# Altium project AMDC.PrjPCB (part 2 of 4)

## Sheet TranslationDir8Chan.SchDoc: 8-Channel Directional Translation
size Letter; Engineer: Nathan Petersen; DocumentNumber: 15; Revision: v1.2; SheetNumber: 15; SheetTotal: 23
Used 8 times, as channels U_PicoZed/U_DriveInterface/U_InverterTranslation/U_TranslationStsA, U_PicoZed/U_DriveInterface/U_InverterTranslation/U_TranslationStsB, U_PicoZed/U_DriveInterface/U_InverterTranslation/U_TranslationStsC, U_PicoZed/U_DriveInterface/U_InverterTranslation/U_TranslationStsD, U_PicoZed/U_GPIO/U_TranslationGPIO_IN_A, U_PicoZed/U_GPIO/U_TranslationGPIO_OUT_A, U_PicoZed/U_GPIO/U_TranslationGPIO_IN_B, U_PicoZed/U_GPIO/U_TranslationGPIO_OUT_B. Parts and nets are listed once, with the designators drawn on the sheet.
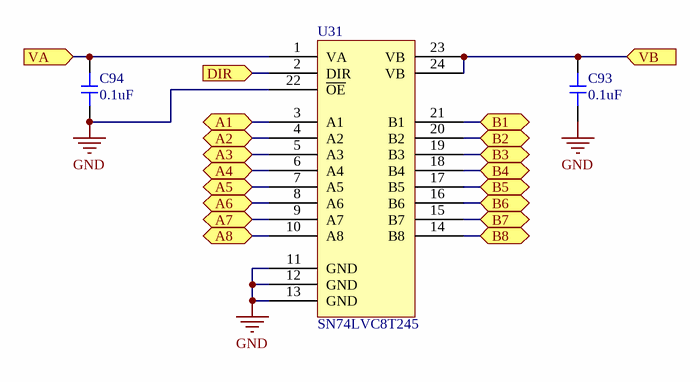
[diagram p7: TranslationDir8Chan.SchDoc]

### Parts
C93  value 0.1uF  [0603-CAP]  (hidden comment: Capacitor)
C94  value 0.1uF  [0603-CAP]  (hidden comment: Capacitor)
U31  SN74LVC8T245  [TSOP65P640X120-24N]

### Ports
A1 (bidir), A2 (bidir), A3 (bidir), A4 (bidir), A5 (bidir), A6 (bidir), A7 (bidir), A8 (bidir), B1 (bidir), B2 (bidir), B3 (bidir), B4 (bidir), B5 (bidir), B6 (bidir), B7 (bidir), B8 (bidir), DIR (in), VA (in), VB (in)

### Nets
GND: C93.2 C94.2 U31.11(GND) U31.12(GND) U31.13(GND) U31.22(~{OE})
A1: U31.3(A1) ; port A1
A2: U31.4(A2) ; port A2
A3: U31.5(A3) ; port A3
A4: U31.6(A4) ; port A4
A5: U31.7(A5) ; port A5
A6: U31.8(A6) ; port A6
A7: U31.9(A7) ; port A7
A8: U31.10(A8) ; port A8
B1: U31.21(B1) ; port B1
B2: U31.20(B2) ; port B2
B3: U31.19(B3) ; port B3
B4: U31.18(B4) ; port B4
B5: U31.17(B5) ; port B5
B6: U31.16(B6) ; port B6
B7: U31.15(B7) ; port B7
B8: U31.14(B8) ; port B8
DIR: U31.2(DIR) ; port DIR
VA: C94.1 U31.1(VA) ; port VA
VB: C93.1 U31.23(VB) U31.24(VB) ; port VB

### Channels
U_PicoZed/U_DriveInterface/U_InverterTranslation/U_TranslationStsA: designators end in A; ports A1=LV_INV_STS_A1 A2=LV_INV_STS_A2 A3=LV_INV_STS_A3 A4=LV_INV_STS_A4 A5=LV_INV_STS_A5 A6=LV_INV_STS_A6 A7=LV_INV_STS_A7 A8=LV_INV_STS_A8 B1=INV_STS_A1 B2=INV_STS_A2 B3=INV_STS_A3 B4=INV_STS_A4 B5=INV_STS_A5 B6=INV_STS_A6 B7=INV_STS_A7 B8=INV_STS_A8 DIR=INV_STS_A_DIR VA=1.8V VB=VDDPS
U_PicoZed/U_DriveInterface/U_InverterTranslation/U_TranslationStsB: designators end in B; ports A1=LV_INV_STS_B1 A2=LV_INV_STS_B2 A3=LV_INV_STS_B3 A4=LV_INV_STS_B4 A5=LV_INV_STS_B5 A6=LV_INV_STS_B6 A7=LV_INV_STS_B7 A8=LV_INV_STS_B8 B1=INV_STS_B1 B2=INV_STS_B2 B3=INV_STS_B3 B4=INV_STS_B4 B5=INV_STS_B5 B6=INV_STS_B6 B7=INV_STS_B7 B8=INV_STS_B8 DIR=INV_STS_B_DIR VA=1.8V VB=VDDPS
U_PicoZed/U_DriveInterface/U_InverterTranslation/U_TranslationStsC: designators end in C; ports A1=LV_INV_STS_C1 A2=LV_INV_STS_C2 A3=LV_INV_STS_C3 A4=LV_INV_STS_C4 A5=LV_INV_STS_C5 A6=LV_INV_STS_C6 A7=LV_INV_STS_C7 A8=LV_INV_STS_C8 B1=INV_STS_C1 B2=INV_STS_C2 B3=INV_STS_C3 B4=INV_STS_C4 B5=INV_STS_C5 B6=INV_STS_C6 B7=INV_STS_C7 B8=INV_STS_C8 DIR=INV_STS_C_DIR VA=1.8V VB=VDDPS
U_PicoZed/U_DriveInterface/U_InverterTranslation/U_TranslationStsD: designators end in D; ports A1=LV_INV_STS_D1 A2=LV_INV_STS_D2 A3=LV_INV_STS_D3 A4=LV_INV_STS_D4 A5=LV_INV_STS_D5 A6=LV_INV_STS_D6 A7=LV_INV_STS_D7 A8=LV_INV_STS_D8 B1=INV_STS_D1 B2=INV_STS_D2 B3=INV_STS_D3 B4=INV_STS_D4 B5=INV_STS_D5 B6=INV_STS_D6 B7=INV_STS_D7 B8=INV_STS_D8 DIR=INV_STS_D_DIR VA=1.8V VB=VDDPS
U_PicoZed/U_GPIO/U_TranslationGPIO_IN_A: designators end in E; ports A1=LV_GPIO1_IN1 A2=LV_GPIO1_IN2 A3=LV_GPIO1_IN3 A4=LV_GPIO2_IN1 A5=LV_GPIO2_IN2 A6=LV_GPIO2_IN3 A7=NetU31E_9 A8=NetU31E_10 B1=GPIO1_IN1 B2=GPIO1_IN2 B3=GPIO1_IN3 B4=GPIO2_IN1 B5=GPIO2_IN2 B6=GPIO2_IN3 B7=GND B8=GND DIR=GND VA=1.8V VB=5V
U_PicoZed/U_GPIO/U_TranslationGPIO_OUT_A: designators end in F; ports A1=LV_GPIO1_OUT1 A2=LV_GPIO1_OUT2 A3=LV_GPIO1_OUT3 A4=LV_GPIO2_OUT1 A5=LV_GPIO2_OUT2 A6=LV_GPIO2_OUT3 A7=GND A8=GND B1=GPIO1_OUT1 B2=GPIO1_OUT2 B3=GPIO1_OUT3 B4=GPIO2_OUT1 B5=GPIO2_OUT2 B6=GPIO2_OUT3 B7=NetU31F_15 B8=NetU31F_14 DIR=1.8V VA=1.8V VB=5V
U_PicoZed/U_GPIO/U_TranslationGPIO_IN_B: designators end in G; ports A1=LV_GPIO3_IN1 A2=LV_GPIO3_IN2 A3=LV_GPIO3_IN3 A4=LV_GPIO4_IN1 A5=LV_GPIO4_IN2 A6=LV_GPIO4_IN3 A7=NetU31G_9 A8=NetU31G_10 B1=GPIO3_IN1 B2=GPIO3_IN2 B3=GPIO3_IN3 B4=GPIO4_IN1 B5=GPIO4_IN2 B6=GPIO4_IN3 B7=GND B8=GND DIR=GND VA=1.8V VB=5V
U_PicoZed/U_GPIO/U_TranslationGPIO_OUT_B: designators end in H; ports A1=LV_GPIO3_OUT1 A2=LV_GPIO3_OUT2 A3=LV_GPIO3_OUT3 A4=LV_GPIO4_OUT1 A5=LV_GPIO4_OUT2 A6=LV_GPIO4_OUT3 A7=GND A8=GND B1=GPIO3_OUT1 B2=GPIO3_OUT2 B3=GPIO3_OUT3 B4=GPIO4_OUT1 B5=GPIO4_OUT2 B6=GPIO4_OUT3 B7=NetU31H_15 B8=NetU31H_14 DIR=1.8V VA=1.8V VB=5V

### Notes on the sheet
- Title:
- File:
- Sheet:
- of
- Revision:
- Time:
- Date:
- Engineer:

### Library data of the parts
U31 = SN74LVC8T245PWR: IC BUS TRANSCVR 8BIT 24TSSOP; Supplier 1: Digi-Key; Supplier Part Number 1: 296-18593-1-ND
C93 C94 = Capacitor: Supplier 1: Digi-Key; Supplier Part Number 1: 1276-1012-6-ND

## Sheet AnalogInterface.SchDoc: Analog Interface
size Letter; Engineer: Nathan Petersen; DocumentNumber: 6; Revision: v1.2; SheetNumber: 6; SheetTotal: 23
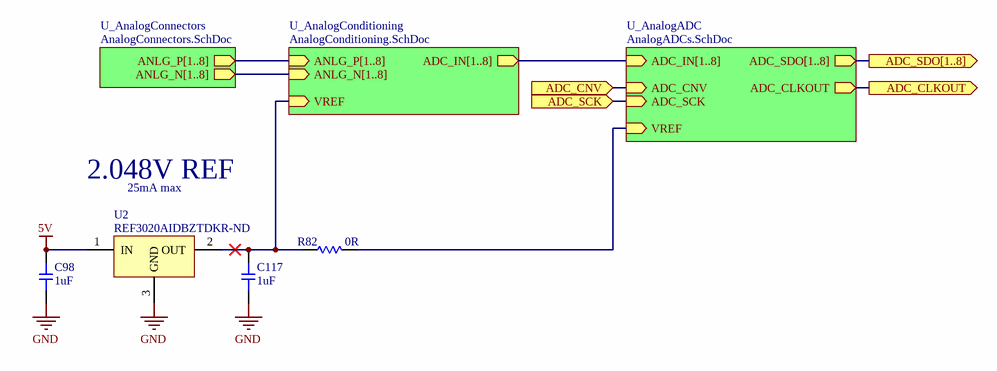
[diagram p8: AnalogInterface.SchDoc]

### Parts
C98  value 1uF  [0603-CAP]  (hidden comment: Capacitor)
C117  value 1uF  [0603-CAP]  (hidden comment: Capacitor)
R82  value 0R  [1206-RES]  (hidden comment: Resistor)
U2  Supplier Part Number 1: REF3020AIDBZTDKR-ND  [SOT23-3]  (hidden comment: REF3020AIDBZT)

### Sub-sheets
U_AnalogADC = AnalogADCs.SchDoc: ADC_IN[1..8] (in), ADC_SDO[1..8] (out), ADC_CNV (in), ADC_SCK (in), ADC_CLKOUT (out), VREF (in)
U_AnalogConditioning = AnalogConditioning.SchDoc: ADC_IN[1..8] (out), ANLG_N[1..8] (in), ANLG_P[1..8] (in), VREF (in)
U_AnalogConnectors = AnalogConnectors.SchDoc: ANLG_P[1..8] (out), ANLG_N[1..8] (out)

### Ports
ADC_CLKOUT (out), ADC_CNV (in), ADC_SCK (in), ADC_SDO[1..8] (out)

### Nets
5V: C98.2 U2.1(IN)
GND: C98.1 C117.1 U2.3(GND)
ADC_CLKOUT: port ADC_CLKOUT, sheet U_AnalogADC/ADC_CLKOUT
ADC_CNV: port ADC_CNV, sheet U_AnalogADC/ADC_CNV
ADC_SCK: port ADC_SCK, sheet U_AnalogADC/ADC_SCK
VREF: R82.2 ; sheet U_AnalogADC/VREF
NetC117_2: C117.2 R82.1 U2.2(OUT) ; sheet U_AnalogConditioning/VREF

### Buses and harness runs
bus port ADC_SDO[1..8] = sheet U_AnalogADC/ADC_SDO[1..8]
bus sheet U_AnalogADC/ADC_IN[1..8] = sheet U_AnalogConditioning/ADC_IN[1..8]
bus sheet U_AnalogConditioning/ANLG_N[1..8] = sheet U_AnalogConnectors/ANLG_N[1..8]
bus sheet U_AnalogConditioning/ANLG_P[1..8] = sheet U_AnalogConnectors/ANLG_P[1..8]

### Notes on the sheet
- 2.048V REF
- 25mA max
- Title:
- File:
- Sheet:
- of
- Revision:
- Time:
- Date:
- Engineer:

### Library data of the parts
U2 = REF3020AIDBZT: Series Voltage Reference IC ±0.2% 25mA SOT-23-3; Supplier 1: Digi-Key
C98 C117 = Capacitor: Supplier 1: Digi-Key; Supplier Part Number 1: 1276-6524-6-ND
R82 = Resistor: Supplier 1: Digi-Key; Supplier Part Number 1: 311-0.0ERCT-ND

## Sheet AnalogADCs.SchDoc: ADC
size Letter; Engineer: Nathan Petersen; DocumentNumber: 10; Revision: v1.2; SheetNumber: 10; SheetTotal: 23
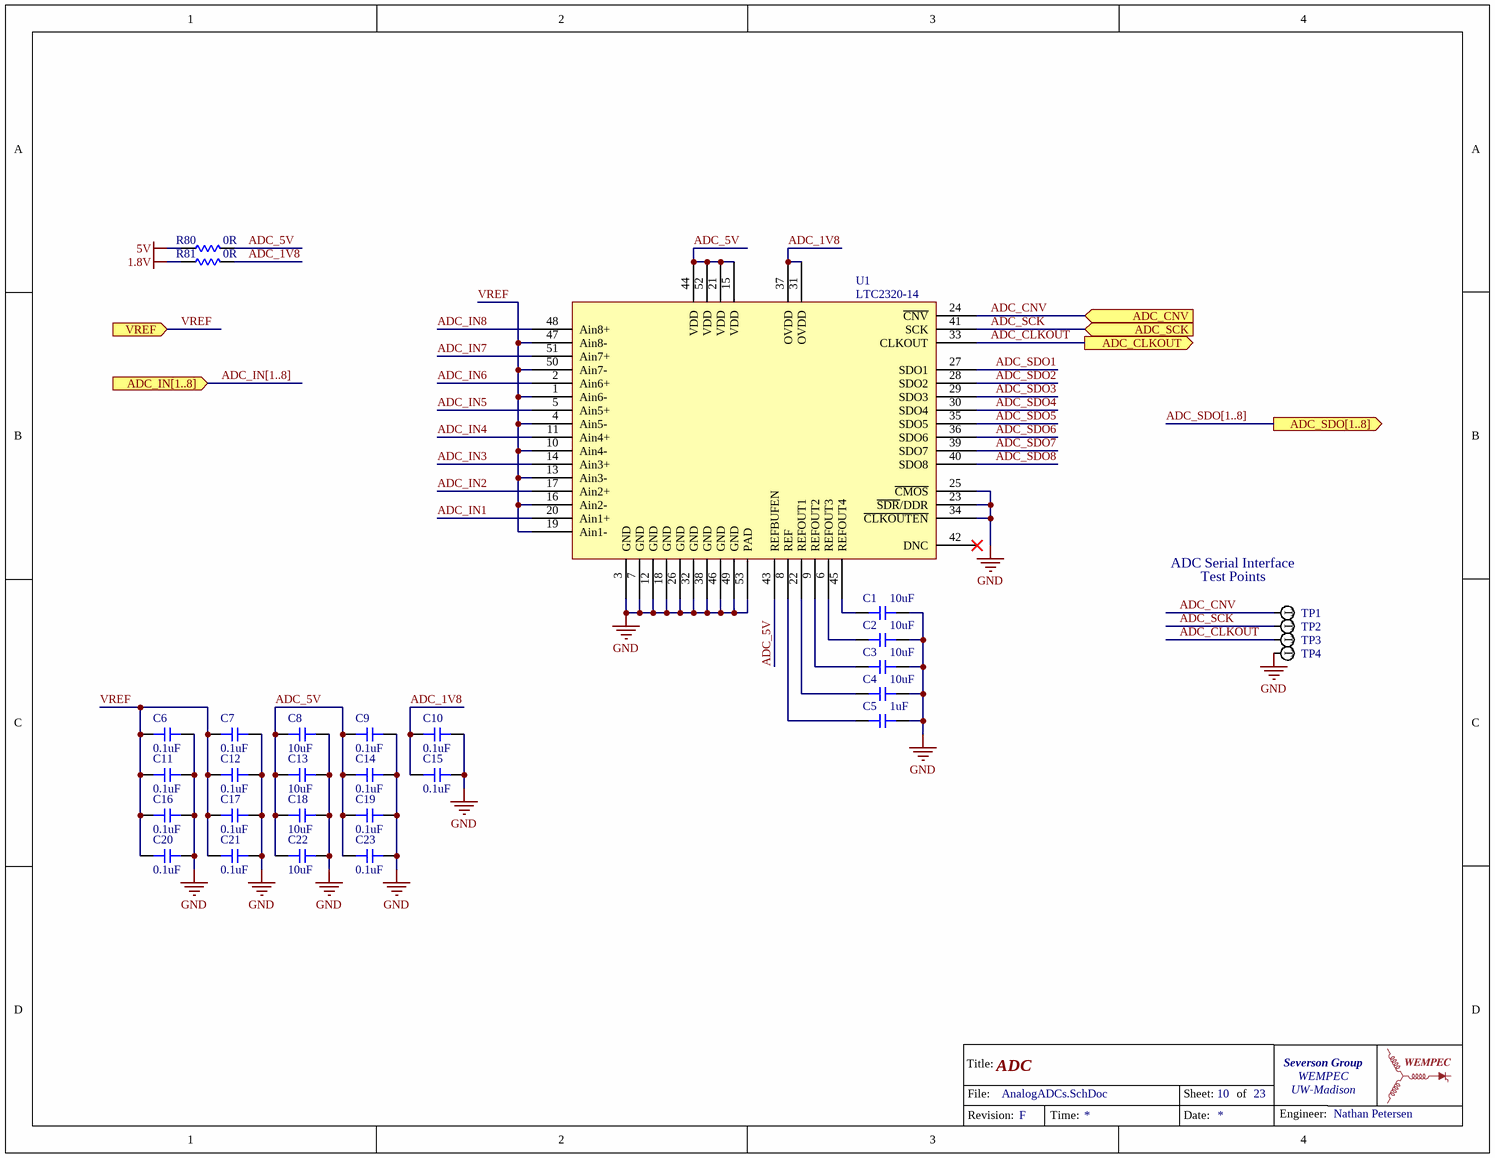
[diagram p9: AnalogADCs.SchDoc]

### Parts
C1  value 10uF  [0603-CAP]  (hidden comment: Capacitor)
C2  value 10uF  [0603-CAP]  (hidden comment: Capacitor)
C3  value 10uF  [0603-CAP]  (hidden comment: Capacitor)
C4  value 10uF  [0603-CAP]  (hidden comment: Capacitor)
C5  value 1uF  [0603-CAP]  (hidden comment: Capacitor)
C6  value 0.1uF  [0603-CAP]  (hidden comment: Capacitor)
C7  value 0.1uF  [0603-CAP]  (hidden comment: Capacitor)
C8  value 10uF  [0603-CAP]  (hidden comment: Capacitor)
C9  value 0.1uF  [0603-CAP]  (hidden comment: Capacitor)
C10  value 0.1uF  [0603-CAP]  (hidden comment: Capacitor)
C11  value 0.1uF  [0603-CAP]  (hidden comment: Capacitor)
C12  value 0.1uF  [0603-CAP]  (hidden comment: Capacitor)
C13  value 10uF  [0603-CAP]  (hidden comment: Capacitor)
C14  value 0.1uF  [0603-CAP]  (hidden comment: Capacitor)
C15  value 0.1uF  [0603-CAP]  (hidden comment: Capacitor)
C16  value 0.1uF  [0603-CAP]  (hidden comment: Capacitor)
C17  value 0.1uF  [0603-CAP]  (hidden comment: Capacitor)
C18  value 10uF  [0603-CAP]  (hidden comment: Capacitor)
C19  value 0.1uF  [0603-CAP]  (hidden comment: Capacitor)
C20  value 0.1uF  [0603-CAP]  (hidden comment: Capacitor)
C21  value 0.1uF  [0603-CAP]  (hidden comment: Capacitor)
C22  value 10uF  [0603-CAP]  (hidden comment: Capacitor)
C23  value 0.1uF  [0603-CAP]  (hidden comment: Capacitor)
R80  value 0R  [1206-RES]  (hidden comment: Resistor)
R81  value 0R  [1206-RES]  (hidden comment: Resistor)
TP1  Test Point  [RCU-0C]  (value not drawn)
TP2  Test Point  [RCU-0C]  (value not drawn)
TP3  Test Point  [RCU-0C]  (value not drawn)
TP4  Test Point  [RCU-0C]  (value not drawn)
U1  LTC2320-14  [QFN50P700X800X80_HS-53N]

### Ports
ADC_CLKOUT (out), ADC_CNV (in), ADC_IN[1..8] (in), ADC_SCK (in), ADC_SDO[1..8] (out), VREF (in)

### Nets
1.8V: R81.1
5V: R80.1
GND: C1.2 C2.2 C3.2 C4.2 C5.2 C6.2 C7.2 C8.2 C9.2 C10.2 C11.2 C12.2 C13.2 C14.2 C15.2 C16.2 C17.2 C18.2 C19.2 C20.2 C21.2 C22.2 C23.2 TP4.1 U1.3(GND) U1.7(GND) U1.12(GND) U1.18(GND) U1.23(~{SDR}/DDR) U1.25(~{CMOS}) U1.26(GND) U1.32(GND) U1.34(~{CLKOUTEN}) U1.38(GND) U1.46(GND) U1.49(GND) U1.53(PAD)
ADC_1V8: C10.1 C15.1 R81.2 U1.31(OVDD) U1.37(OVDD)
ADC_5V: C8.1 C9.1 C13.1 C14.1 C18.1 C19.1 C22.1 C23.1 R80.2 U1.15(VDD) U1.21(VDD) U1.43(REFBUFEN) U1.44(VDD) U1.52(VDD)
ADC_CLKOUT: TP3.1 U1.33(CLKOUT) ; port ADC_CLKOUT
ADC_CNV: TP1.1 U1.24(~{CNV}) ; port ADC_CNV
ADC_IN1: U1.20(Ain1+)
ADC_IN2: U1.17(Ain2+)
ADC_IN3: U1.14(Ain3+)
ADC_IN4: U1.11(Ain4+)
ADC_IN5: U1.5(Ain5+)
ADC_IN6: U1.2(Ain6+)
ADC_IN7: U1.51(Ain7+)
ADC_IN8: U1.48(Ain8+)
ADC_SCK: TP2.1 U1.41(SCK) ; port ADC_SCK
ADC_SDO1: U1.27(SDO1)
ADC_SDO2: U1.28(SDO2)
ADC_SDO3: U1.29(SDO3)
ADC_SDO4: U1.30(SDO4)
ADC_SDO5: U1.35(SDO5)
ADC_SDO6: U1.36(SDO6)
ADC_SDO7: U1.39(SDO7)
ADC_SDO8: U1.40(SDO8)
VREF: C6.1 C7.1 C11.1 C12.1 C16.1 C17.1 C20.1 C21.1 U1.1(Ain6-) U1.4(Ain5-) U1.10(Ain4-) U1.13(Ain3-) U1.16(Ain2-) U1.19(Ain1-) U1.47(Ain8-) U1.50(Ain7-) ; port VREF
NetC1_1: C1.1 U1.45(REFOUT4)
NetC2_1: C2.1 U1.6(REFOUT3)
NetC3_1: C3.1 U1.9(REFOUT2)
NetC4_1: C4.1 U1.22(REFOUT1)
NetC5_1: C5.1 U1.8(REF)

Not connected (* = marked no-connect by the designer): U1 42(DNC)*

### Buses and harness runs
bus ADC_IN[1..8] = port ADC_IN[1..8]
bus ADC_SDO[1..8] = port ADC_SDO[1..8]

### Notes on the sheet
- ADC Serial Interface
- Test Points
- Title:
- File:
- Sheet:
- of
- Revision:
- Time:
- Date:
- Engineer:
- (in symbol Test Point) T

### Library data of the parts
U1 = LTC2320-14: IC ADC 14BIT 1.5MSPS SAR 52QFN - 14 Bit Analog to Digital Converter 8 Input 4 SAR 52-QFN (7x8); Supplier 1: Digi-Key; Supplier Part Number 1: LTC2320CUKG-14#PBF-ND
C1-C23 = Capacitor: Supplier 1: Digi-Key
  C1: Supplier Part Number 1: 1276-1192-6-ND
  C2-C4 C8 C13 C18 C22: Supplier Part Number 1: 1276-1119-6-ND
  C5: Supplier Part Number 1: 1276-6524-6-ND
  C6 C7 C9-C12 C14-C17 C19-C21 C23: Supplier Part Number 1: 1276-1012-6-ND
R80 R81 = Resistor: Supplier 1: Digi-Key; Supplier Part Number 1: 311-0.0ERCT-ND
TP1-TP4 = Test Point: Footprint: *; Supplier 1: Digi-Key; Supplier Part Number 1: A106145CT-ND

## Sheet AnalogConnectors.SchDoc: Analog RJ45 Connectors
size Letter; Engineer: Nathan Petersen; DocumentNumber: 7; Revision: v1.2; SheetNumber: 7; SheetTotal: 23
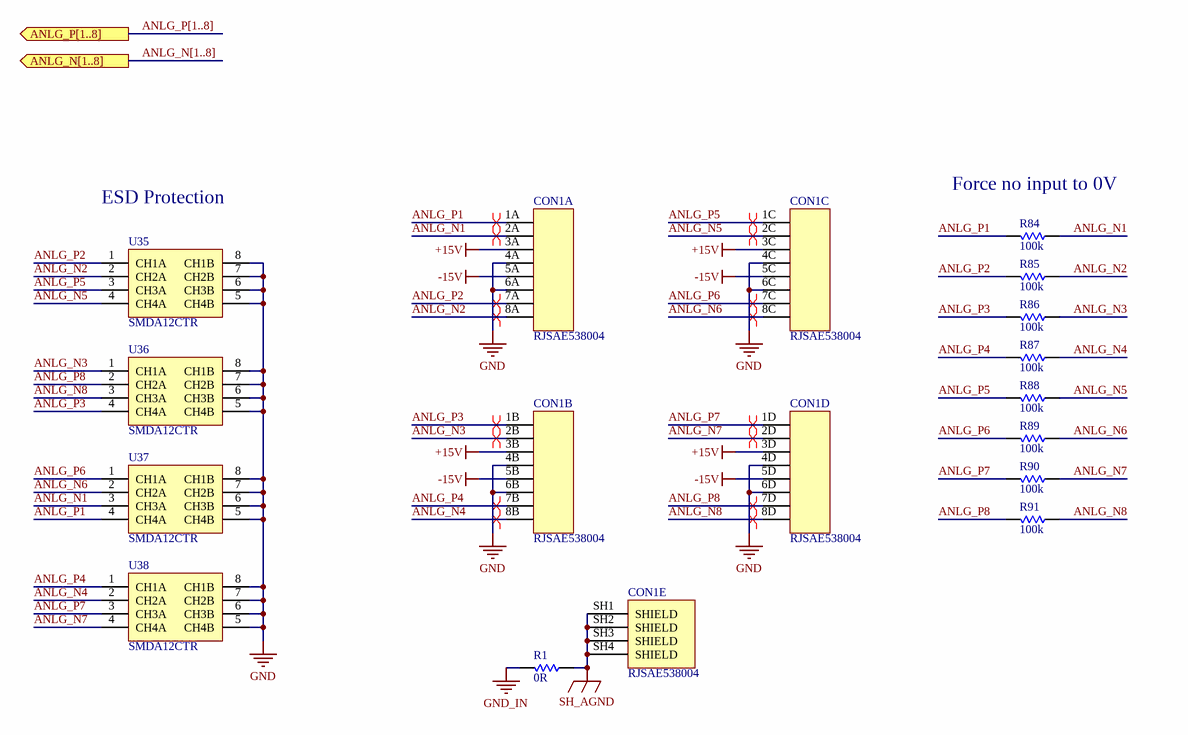
[diagram p10: AnalogConnectors.SchDoc]

### Parts
CON1  RJSAE538004  [RJSAE538004]  (parts A,B,C,D,E of 5)
R1  value 0R  [1206-RES]  (hidden comment: Resistor)
R84  value 100k  [0603-RES]  (hidden comment: Resistor)
R85  value 100k  [0603-RES]  (hidden comment: Resistor)
R86  value 100k  [0603-RES]  (hidden comment: Resistor)
R87  value 100k  [0603-RES]  (hidden comment: Resistor)
R88  value 100k  [0603-RES]  (hidden comment: Resistor)
R89  value 100k  [0603-RES]  (hidden comment: Resistor)
R90  value 100k  [0603-RES]  (hidden comment: Resistor)
R91  value 100k  [0603-RES]  (hidden comment: Resistor)
U35  SMDA12CTR  [SOIC127P600X175-8N]
U36  SMDA12CTR  [SOIC127P600X175-8N]
U37  SMDA12CTR  [SOIC127P600X175-8N]
U38  SMDA12CTR  [SOIC127P600X175-8N]

### Ports
ANLG_N[1..8] (out), ANLG_P[1..8] (out)

### Nets
+15V: CON1.3A CON1.3B CON1.3C CON1.3D
-15V: CON1.5A CON1.5B CON1.5C CON1.5D
GND: CON1.4A CON1.4B CON1.4C CON1.4D CON1.6A CON1.6B CON1.6C CON1.6D U35.5(CH4B) U35.6(CH3B) U35.7(CH2B) U35.8(CH1B) U36.5(CH4B) U36.6(CH3B) U36.7(CH2B) U36.8(CH1B) U37.5(CH4B) U37.6(CH3B) U37.7(CH2B) U37.8(CH1B) U38.5(CH4B) U38.6(CH3B) U38.7(CH2B) U38.8(CH1B)
GND_IN: R1.2
SH_AGND: CON1.SH1(SHIELD) CON1.SH2(SHIELD) CON1.SH3(SHIELD) CON1.SH4(SHIELD) R1.1
ANLG_N1: CON1.2A R84.1 U37.3(CH3A)
ANLG_N2: CON1.8A R85.1 U35.2(CH2A)
ANLG_N3: CON1.2B R86.1 U36.1(CH1A)
ANLG_N4: CON1.8B R87.1 U38.2(CH2A)
ANLG_N5: CON1.2C R88.1 U35.4(CH4A)
ANLG_N6: CON1.8C R89.1 U37.2(CH2A)
ANLG_N7: CON1.2D R90.1 U38.4(CH4A)
ANLG_N8: CON1.8D R91.1 U36.3(CH3A)
ANLG_P1: CON1.1A R84.2 U37.4(CH4A)
ANLG_P2: CON1.7A R85.2 U35.1(CH1A)
ANLG_P3: CON1.1B R86.2 U36.4(CH4A)
ANLG_P4: CON1.7B R87.2 U38.1(CH1A)
ANLG_P5: CON1.1C R88.2 U35.3(CH3A)
ANLG_P6: CON1.7C R89.2 U37.1(CH1A)
ANLG_P7: CON1.1D R90.2 U38.3(CH3A)
ANLG_P8: CON1.7D R91.2 U36.2(CH2A)

### Buses and harness runs
bus ANLG_N[1..8] = port ANLG_N[1..8]
bus ANLG_P[1..8] = port ANLG_P[1..8]

### Layout directives
differential pair: ANLG_N1, ANLG_N2, ANLG_N3, ANLG_N4, ANLG_N5, ANLG_N6, ANLG_N7, ANLG_N8, ANLG_P1, ANLG_P2, ANLG_P3, ANLG_P4, ANLG_P5, ANLG_P6, ANLG_P7, ANLG_P8

### Notes on the sheet
- ESD Protection
- (near R84) Force no input to 0V
- Title:
- File:
- Sheet:
- of
- Revision:
- Time:
- Date:
- Engineer:

### Library data of the parts
CON1 = RJSAE538004: CONN MOD JACK 8P8C R/A SHIELDED; Supplier 1: Digi-Key; Supplier Part Number 1: RJSAE538004-ND
U35-U38 = SMDA12CTR: TVS DIODE 12V 19V 8SO; Supplier 1: Digi-Key; Supplier Part Number 1: 1655-1701-1-ND
R1 R84-R91 = Resistor: Supplier 1: Digi-Key
  R1: Supplier Part Number 1: 311-0.0ERCT-ND
  R84-R91: Supplier Part Number 1: 311-100KLDCT-ND

## Sheet AnalogConditioning.SchDoc: Analog Signal Conditioning
size Letter; Engineer: Nathan Petersen; DocumentNumber: 8; Revision: v1.2; SheetNumber: 8; SheetTotal: 23
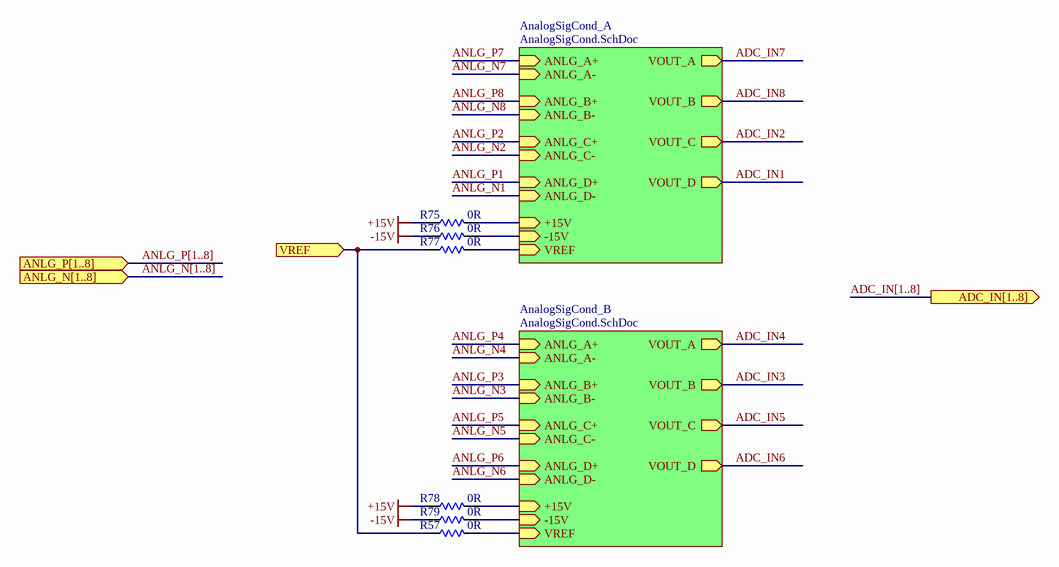
[diagram p11: AnalogConditioning.SchDoc]

### Parts
R57  value 0R  [1206-RES]  (hidden comment: Resistor)
R75  value 0R  [1206-RES]  (hidden comment: Resistor)
R76  value 0R  [1206-RES]  (hidden comment: Resistor)
R77  value 0R  [1206-RES]  (hidden comment: Resistor)
R78  value 0R  [1206-RES]  (hidden comment: Resistor)
R79  value 0R  [1206-RES]  (hidden comment: Resistor)

### Sub-sheets
AnalogSigCond_A = AnalogSigCond.SchDoc: +15V (in), -15V (in), VREF (in), ANLG_A+ (in), ANLG_A- (in), ANLG_B+ (in), ANLG_B- (in), ANLG_C+ (in), ANLG_C- (in), ANLG_D+ (in), ANLG_D- (in), VOUT_A (out), VOUT_B (out), VOUT_C (out), VOUT_D (out)
AnalogSigCond_B = AnalogSigCond.SchDoc: +15V (in), -15V (in), VREF (in), ANLG_A+ (in), ANLG_A- (in), ANLG_B+ (in), ANLG_B- (in), ANLG_C+ (in), ANLG_C- (in), ANLG_D+ (in), ANLG_D- (in), VOUT_A (out), VOUT_B (out), VOUT_C (out), VOUT_D (out)

### Ports
ADC_IN[1..8] (out), ANLG_N[1..8] (in), ANLG_P[1..8] (in), VREF (in)

### Nets
+15V: R75.1 R78.1
-15V: R76.1 R79.1
+15V: R75.2 ; sheet AnalogSigCond_A/+15V  [a separate net that carries the same name]
+15V: R78.2 ; sheet AnalogSigCond_B/+15V  [a separate net that carries the same name]
-15V: R76.2 ; sheet AnalogSigCond_A/-15V  [a separate net that carries the same name]
-15V: R79.2 ; sheet AnalogSigCond_B/-15V  [a separate net that carries the same name]
VREF: R77.2 ; sheet AnalogSigCond_A/VREF
VREF: R57.2 ; sheet AnalogSigCond_B/VREF  [a separate net that carries the same name]
NetC117_2: R57.1 R77.1 ; port VREF

### Buses and harness runs
bus ADC_IN[1..8] = port ADC_IN[1..8]
bus ANLG_N[1..8] = port ANLG_N[1..8]
bus ANLG_P[1..8] = port ANLG_P[1..8]

### Notes on the sheet
- Title:
- File:
- Sheet:
- of
- Revision:
- Time:
- Date:
- Engineer:

### Library data of the parts
R57 R75-R79 = Resistor: Supplier 1: Digi-Key; Supplier Part Number 1: 311-0.0ERCT-ND

## Sheet AnalogSigCond.SchDoc: Analog Signal Front-End
size Letter; Engineer: Nathan Petersen; DocumentNumber: 9; Revision: v1.2; SheetNumber: 9; SheetTotal: 23
Used 2 times, as channels U_PicoZed/U_AnalogInterface/U_AnalogConditioning/AnalogSigCond_A, U_PicoZed/U_AnalogInterface/U_AnalogConditioning/AnalogSigCond_B. Parts and nets are listed once, with the designators drawn on the sheet.
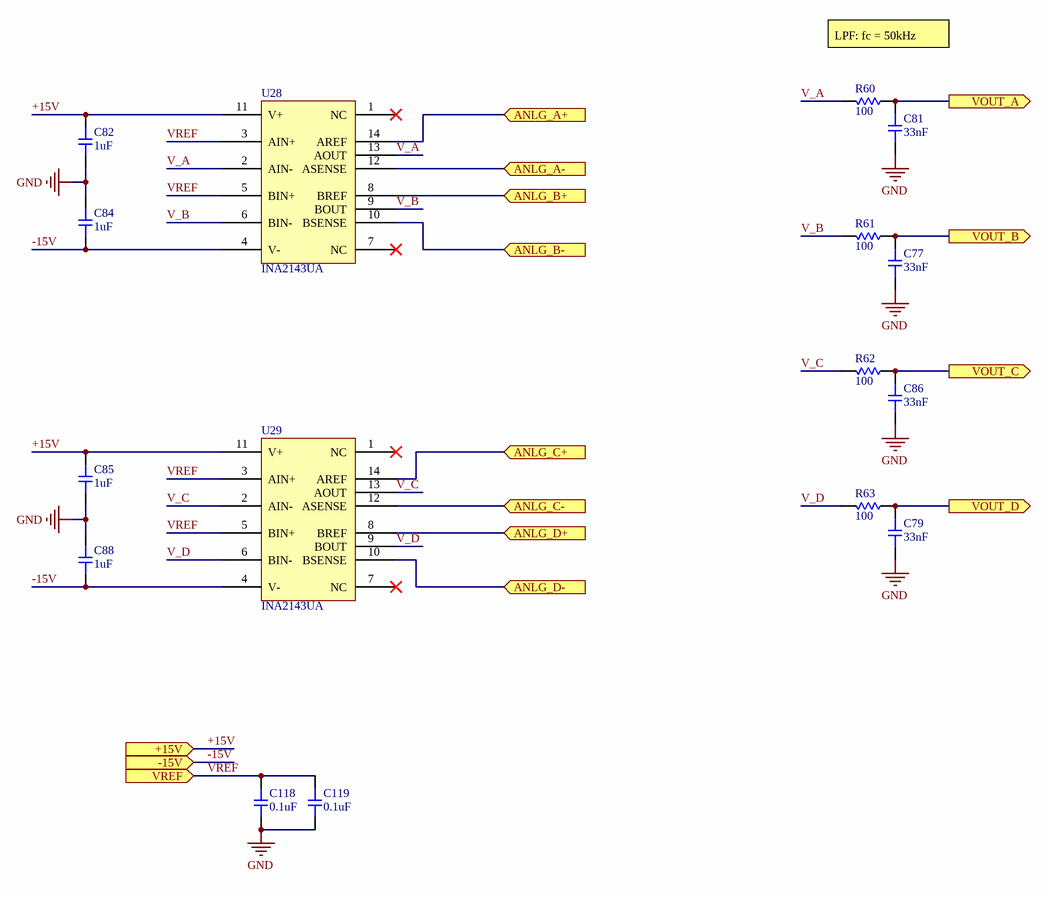
[diagram p12: AnalogSigCond.SchDoc]

### Parts
C77  value 33nF  [0603-CAP]  (hidden comment: Capacitor)
C79  value 33nF  [0603-CAP]  (hidden comment: Capacitor)
C81  value 33nF  [0603-CAP]  (hidden comment: Capacitor)
C82  value 1uF  [0603-CAP]  (hidden comment: Capacitor)
C84  value 1uF  [0603-CAP]  (hidden comment: Capacitor)
C85  value 1uF  [0603-CAP]  (hidden comment: Capacitor)
C86  value 33nF  [0603-CAP]  (hidden comment: Capacitor)
C88  value 1uF  [0603-CAP]  (hidden comment: Capacitor)
C118  value 0.1uF  [0603-CAP]  (hidden comment: Capacitor)
C119  value 0.1uF  [0603-CAP]  (hidden comment: Capacitor)
R60  value 100  [0603-RES]  (hidden comment: Resistor)
R61  value 100  [0603-RES]  (hidden comment: Resistor)
R62  value 100  [0603-RES]  (hidden comment: Resistor)
R63  value 100  [0603-RES]  (hidden comment: Resistor)
U28  INA2143UA  [SOIC127P600X175-14N]
U29  INA2143UA  [SOIC127P600X175-14N]

### Ports
+15V (in), -15V (in), ANLG_A+ (in), ANLG_A- (in), ANLG_B+ (in), ANLG_B- (in), ANLG_C+ (in), ANLG_C- (in), ANLG_D+ (in), ANLG_D- (in), VOUT_A (out), VOUT_B (out), VOUT_C (out), VOUT_D (out), VREF (in)

### Nets
GND: C77.2 C79.2 C81.2 C82.1 C84.2 C85.1 C86.2 C88.2 C118.2 C119.2
+15V: C82.2 C85.2 U28.11(V+) U29.11(V+) ; port +15V
-15V: C84.1 C88.1 U28.4(V-) U29.4(V-) ; port -15V
ANLG_A+: U28.14(AREF) ; port ANLG_A+
ANLG_A-: U28.12(ASENSE) ; port ANLG_A-
ANLG_B+: U28.8(BREF) ; port ANLG_B+
ANLG_B-: U28.10(BSENSE) ; port ANLG_B-
ANLG_C+: U29.14(AREF) ; port ANLG_C+
ANLG_C-: U29.12(ASENSE) ; port ANLG_C-
ANLG_D+: U29.8(BREF) ; port ANLG_D+
ANLG_D-: U29.10(BSENSE) ; port ANLG_D-
V_A: R60.2 U28.2(AIN-) U28.13(AOUT)
V_B: R61.2 U28.6(BIN-) U28.9(BOUT)
V_C: R62.2 U29.2(AIN-) U29.13(AOUT)
V_D: R63.2 U29.6(BIN-) U29.9(BOUT)
VOUT_A: C81.1 R60.1 ; port VOUT_A
VOUT_B: C77.1 R61.1 ; port VOUT_B
VOUT_C: C86.1 R62.1 ; port VOUT_C
VOUT_D: C79.1 R63.1 ; port VOUT_D
VREF: C118.1 C119.1 U28.3(AIN+) U28.5(BIN+) U29.3(AIN+) U29.5(BIN+) ; port VREF

Not connected (* = marked no-connect by the designer): U28 1(NC)* 7(NC)*; U29 1(NC)* 7(NC)*

### Channels
U_PicoZed/U_AnalogInterface/U_AnalogConditioning/AnalogSigCond_A: designators end in A; ports +15V=+15V -15V=-15V ANLG_A+=ANLG_P7 ANLG_A-=ANLG_N7 ANLG_B+=ANLG_P8 ANLG_B-=ANLG_N8 ANLG_C+=ANLG_P2 ANLG_C-=ANLG_N2 ANLG_D+=ANLG_P1 ANLG_D-=ANLG_N1 VOUT_A=ADC_IN7 VOUT_B=ADC_IN8 VOUT_C=ADC_IN2 VOUT_D=ADC_IN1 VREF=VREF
U_PicoZed/U_AnalogInterface/U_AnalogConditioning/AnalogSigCond_B: designators end in B; ports +15V=+15V -15V=-15V ANLG_A+=ANLG_P4 ANLG_A-=ANLG_N4 ANLG_B+=ANLG_P3 ANLG_B-=ANLG_N3 ANLG_C+=ANLG_P5 ANLG_C-=ANLG_N5 ANLG_D+=ANLG_P6 ANLG_D-=ANLG_N6 VOUT_A=ADC_IN4 VOUT_B=ADC_IN3 VOUT_C=ADC_IN5 VOUT_D=ADC_IN6 VREF=VREF

### Notes on the sheet
- LPF: fc = 50kHz
- Title:
- File:
- Sheet:
- of
- Revision:
- Time:
- Date:
- Engineer:

### Library data of the parts
U28 U29 = INA2143UA: IC OPAMP DIFF 150KHZ 14SOIC; Supplier 1: Digi-Key; Supplier Part Number 1: INA2143UA-ND
C77 C79 C81 C82 C84-C86 C88 C118 C119 = Capacitor: Supplier 1: Digi-Key
  C77 C79 C81 C86: Supplier Part Number 1: 1276-2041-1-ND
  C82 C84 C85 C88: Supplier Part Number 1: 1276-6524-6-ND
  C118 C119: Supplier Part Number 1: 1276-1012-6-ND
R60-R63 = Resistor: Supplier 1: Digi-Key; Supplier Part Number 1: YAG3561DKR-ND

## Sheet GbEthernet.SchDoc: SoM Gb Ethernet
size Letter; Engineer: Nathan Petersen; DocumentNumber: 20; Revision: v1.2; SheetNumber: 20; SheetTotal: 23
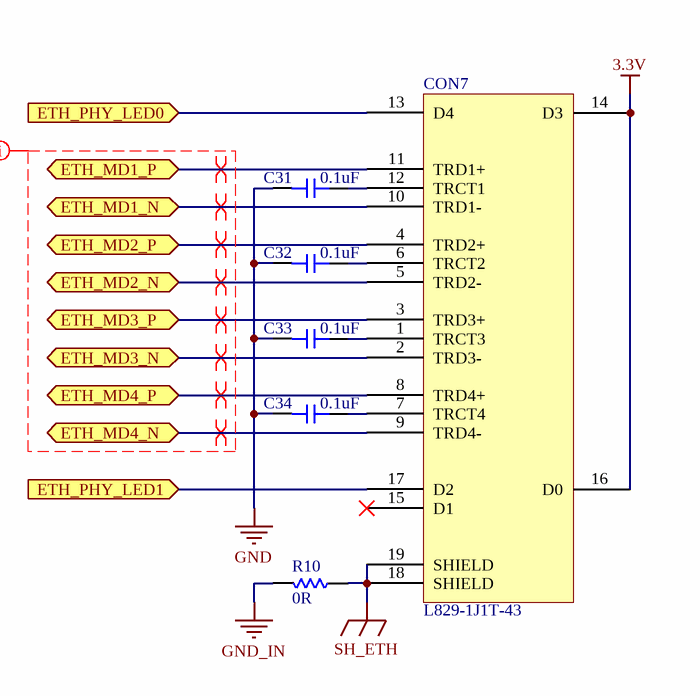
[diagram p13: GbEthernet.SchDoc]

### Parts
C31  value 0.1uF  [0603-CAP]  (hidden comment: Capacitor)
C32  value 0.1uF  [0603-CAP]  (hidden comment: Capacitor)
C33  value 0.1uF  [0603-CAP]  (hidden comment: Capacitor)
C34  value 0.1uF  [0603-CAP]  (hidden comment: Capacitor)
CON7  L829-1J1T-43  [L829-1J1T-43]
R10  value 0R  [1206-RES]  (hidden comment: Resistor)

### Ports
ETH_MD1_N (bidir), ETH_MD1_P (bidir), ETH_MD2_N (bidir), ETH_MD2_P (bidir), ETH_MD3_N (bidir), ETH_MD3_P (bidir), ETH_MD4_N (bidir), ETH_MD4_P (bidir), ETH_PHY_LED0 (in), ETH_PHY_LED1 (in)

### Nets
3.3V: CON7.14(D3) CON7.16(D0)
GND: C31.1 C32.1 C33.1 C34.1
GND_IN: R10.2
SH_ETH: CON7.18(SHIELD) CON7.19(SHIELD) R10.1
ETH_MD1_N: CON7.10(TRD1-) ; port ETH_MD1_N
ETH_MD1_P: CON7.11(TRD1+) ; port ETH_MD1_P
ETH_MD2_N: CON7.5(TRD2-) ; port ETH_MD2_N
ETH_MD2_P: CON7.4(TRD2+) ; port ETH_MD2_P
ETH_MD3_N: CON7.2(TRD3-) ; port ETH_MD3_N
ETH_MD3_P: CON7.3(TRD3+) ; port ETH_MD3_P
ETH_MD4_N: CON7.9(TRD4-) ; port ETH_MD4_N
ETH_MD4_P: CON7.8(TRD4+) ; port ETH_MD4_P
ETH_PHY_LED0: CON7.13(D4) ; port ETH_PHY_LED0
ETH_PHY_LED1: CON7.17(D2) ; port ETH_PHY_LED1
NetC31_2: C31.2 CON7.12(TRCT1)
NetC32_2: C32.2 CON7.6(TRCT2)
NetC33_2: C33.2 CON7.1(TRCT3)
NetC34_2: C34.2 CON7.7(TRCT4)

Not connected (* = marked no-connect by the designer): CON7 15(D1)*

### Layout directives
differential pair: ETH_MD1_N, ETH_MD1_P, ETH_MD2_N, ETH_MD2_P, ETH_MD3_N, ETH_MD3_P, ETH_MD4_N, ETH_MD4_P
net class Ethernet: (no net found under the mark)

### Notes on the sheet
- Title:
- File:
- Sheet:
- of
- Revision:
- Time:
- Date:
- Engineer:

### Library data of the parts
C31-C34 = Capacitor: Supplier 1: Digi-Key; Supplier Part Number 1: 1276-1012-6-ND
CON7 = L829-1J1T-43: Supplier 1: Digi-Key; Supplier Part Number 1: 380-1110-ND
R10 = Resistor: Supplier 1: Digi-Key; Supplier Part Number 1: 311-0.0ERCT-ND

## Sheet Encoder.SchDoc: Encoders
size Letter; Engineer: Nathan Petersen; DocumentNumber: 18; Revision: v1.2; SheetNumber: 18; SheetTotal: 23
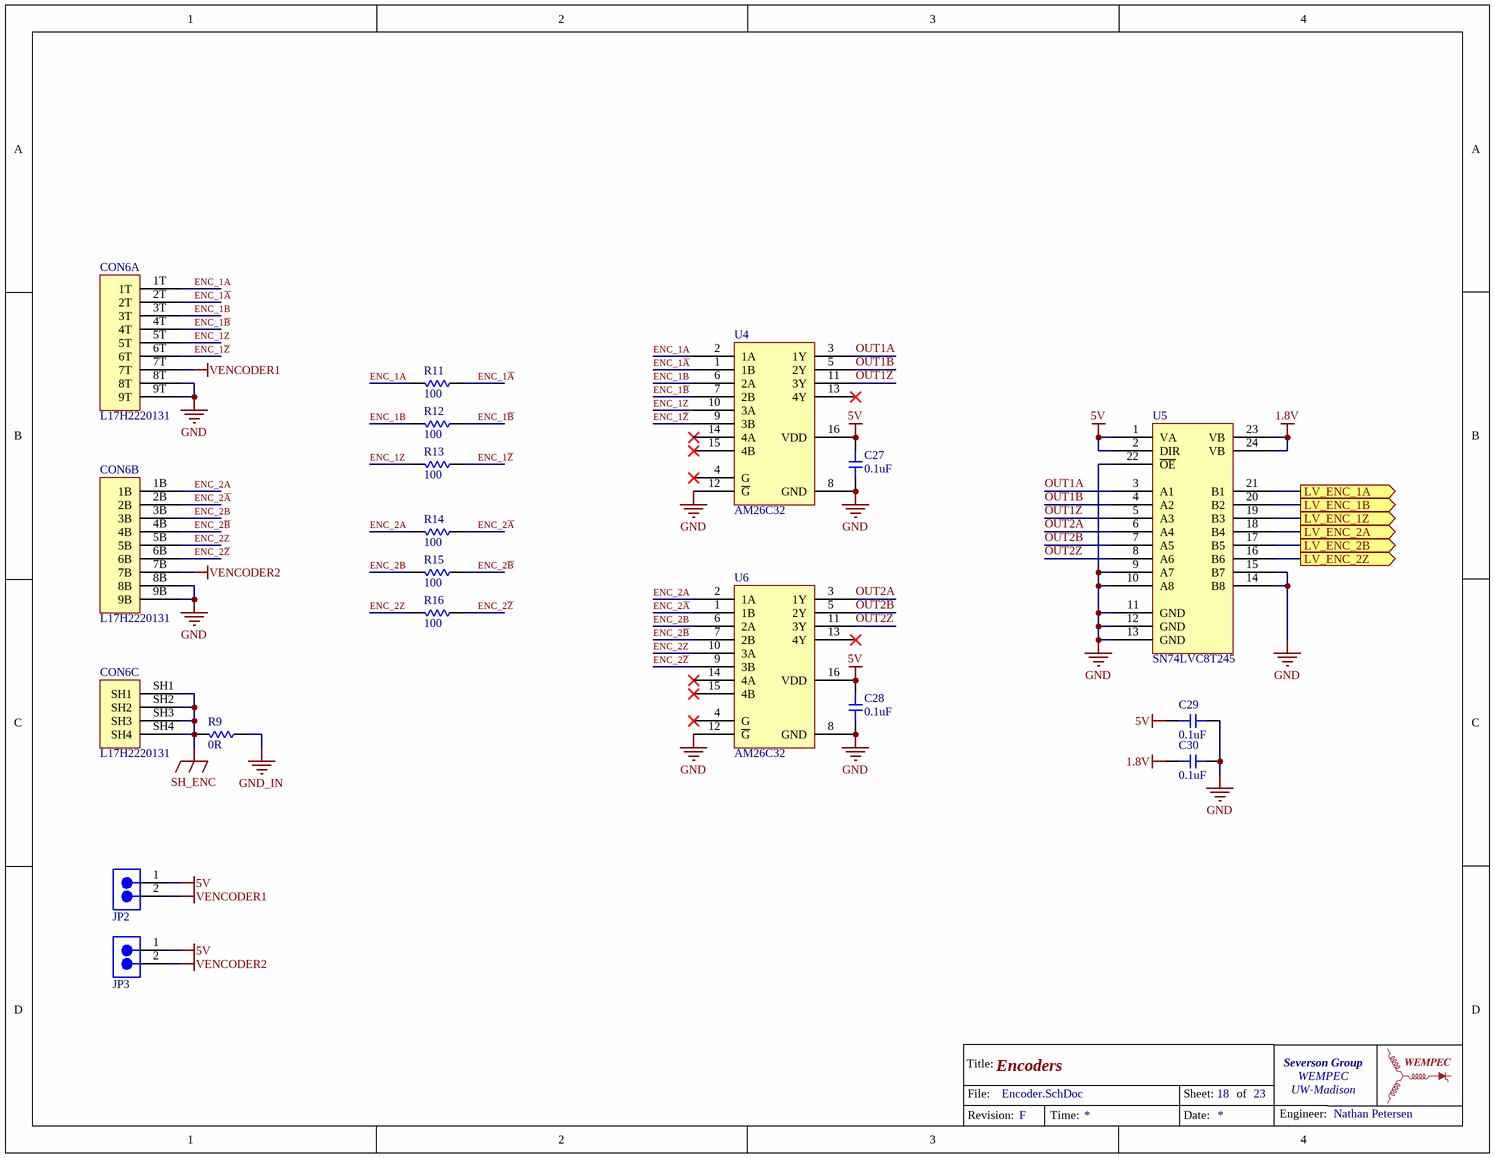
[diagram p14: Encoder.SchDoc]

### Parts
C27  value 0.1uF  [0603-CAP]  (hidden comment: Capacitor)
C28  value 0.1uF  [0603-CAP]  (hidden comment: Capacitor)
C29  value 0.1uF  [0603-CAP]  (hidden comment: Capacitor)
C30  value 0.1uF  [0603-CAP]  (hidden comment: Capacitor)
CON6  L17H2220131  [L17H2220131]  (parts A,B,C of 3)
JP2  Jumper2  [PIN_HEADER_1x2]  (value not drawn)
JP3  Jumper2  [PIN_HEADER_1x2]  (value not drawn)
R9  value 0R  [1206-RES]  (hidden comment: Resistor)
R11  value 100  [0603-RES]  (hidden comment: Resistor)
R12  value 100  [0603-RES]  (hidden comment: Resistor)
R13  value 100  [0603-RES]  (hidden comment: Resistor)
R14  value 100  [0603-RES]  (hidden comment: Resistor)
R15  value 100  [0603-RES]  (hidden comment: Resistor)
R16  value 100  [0603-RES]  (hidden comment: Resistor)
U4  AM26C32  [TSOP65P640X120-16N]
U5  SN74LVC8T245  [TSOP65P640X120-24N]
U6  AM26C32  [TSOP65P640X120-16N]

### Ports
LV_ENC_1A (out), LV_ENC_1B (out), LV_ENC_1Z (out), LV_ENC_2A (out), LV_ENC_2B (out), LV_ENC_2Z (out)

### Nets
1.8V: C30.1 U5.23(VB) U5.24(VB)
5V: C27.2 C28.2 C29.1 JP2.1 JP3.1 U4.16(VDD) U5.1(VA) U5.2(DIR) U6.16(VDD)
GND: C27.1 C28.1 C29.2 C30.2 CON6.8B CON6.8T CON6.9B CON6.9T U4.8(GND) U4.12(~{G}) U5.9(A7) U5.10(A8) U5.11(GND) U5.12(GND) U5.13(GND) U5.14(B8) U5.15(B7) U5.22(~{OE}) U6.8(GND) U6.12(~{G})
GND_IN: R9.1
SH_ENC: CON6.SH1 CON6.SH2 CON6.SH3 CON6.SH4 R9.2
VENCODER1: CON6.7T JP2.2
VENCODER2: CON6.7B JP3.2
ENC_1A: CON6.1T R11.2 U4.2(1A)
ENC_1~{A}: CON6.2T R11.1 U4.1(1B)
ENC_1B: CON6.3T R12.2 U4.6(2A)
ENC_1~{B}: CON6.4T R12.1 U4.7(2B)
ENC_1Z: CON6.5T R13.2 U4.10(3A)
ENC_1~{Z}: CON6.6T R13.1 U4.9(3B)
ENC_2A: CON6.1B R14.2 U6.2(1A)
ENC_2~{A}: CON6.2B R14.1 U6.1(1B)
ENC_2B: CON6.3B R15.2 U6.6(2A)
ENC_2~{B}: CON6.4B R15.1 U6.7(2B)
ENC_2Z: CON6.5B R16.2 U6.10(3A)
ENC_2~{Z}: CON6.6B R16.1 U6.9(3B)
LV_ENC_1A: U5.21(B1) ; port LV_ENC_1A
LV_ENC_1B: U5.20(B2) ; port LV_ENC_1B
LV_ENC_1Z: U5.19(B3) ; port LV_ENC_1Z
LV_ENC_2A: U5.18(B4) ; port LV_ENC_2A
LV_ENC_2B: U5.17(B5) ; port LV_ENC_2B
LV_ENC_2Z: U5.16(B6) ; port LV_ENC_2Z
OUT1A: U4.3(1Y) U5.3(A1)
OUT1B: U4.5(2Y) U5.4(A2)
OUT1Z: U4.11(3Y) U5.5(A3)
OUT2A: U5.6(A4) U6.3(1Y)
OUT2B: U5.7(A5) U6.5(2Y)
OUT2Z: U5.8(A6) U6.11(3Y)

Not connected (* = marked no-connect by the designer): U4 4(G)* 13(4Y)* 14(4A)* 15(4B)*; U6 4(G)* 13(4Y)* 14(4A)* 15(4B)*

### Notes on the sheet
- Title:
- File:
- Sheet:
- of
- Revision:
- Time:
- Date:
- Engineer:

### Library data of the parts
CON6 = L17H2220131: CONN D-SUB RCPT 9POS R/A SLDR; Supplier 1: Digi-Key; Supplier Part Number 1: L17H2220131-ND
U4 U6 = AM26C32: IC RCVR RS422 QUAD DIFF 16TSSOP; Supplier 1: Digi-Key; Supplier Part Number 1: 296-30088-1-ND
U5 = SN74LVC8T245PWR: IC BUS TRANSCVR 8BIT 24TSSOP; Supplier 1: Digi-Key; Supplier Part Number 1: 296-18593-1-ND
C27-C30 = Capacitor: Supplier 1: Digi-Key; Supplier Part Number 1: 1276-1012-6-ND
JP2 JP3 = Jumper2: Supplier 1: Digi-Key; Supplier Part Number 1: 732-5315-ND
R9 R11-R16 = Resistor: Supplier 1: Digi-Key
  R9: Supplier Part Number 1: 311-0.0ERCT-ND
  R11-R16: Supplier Part Number 1: YAG3561DKR-ND

## Sheet BoardIO.SchDoc: Board I/O
size Letter; Engineer: Nathan Petersen; DocumentNumber: 11; Revision: v1.2; SheetNumber: 11; SheetTotal: 23
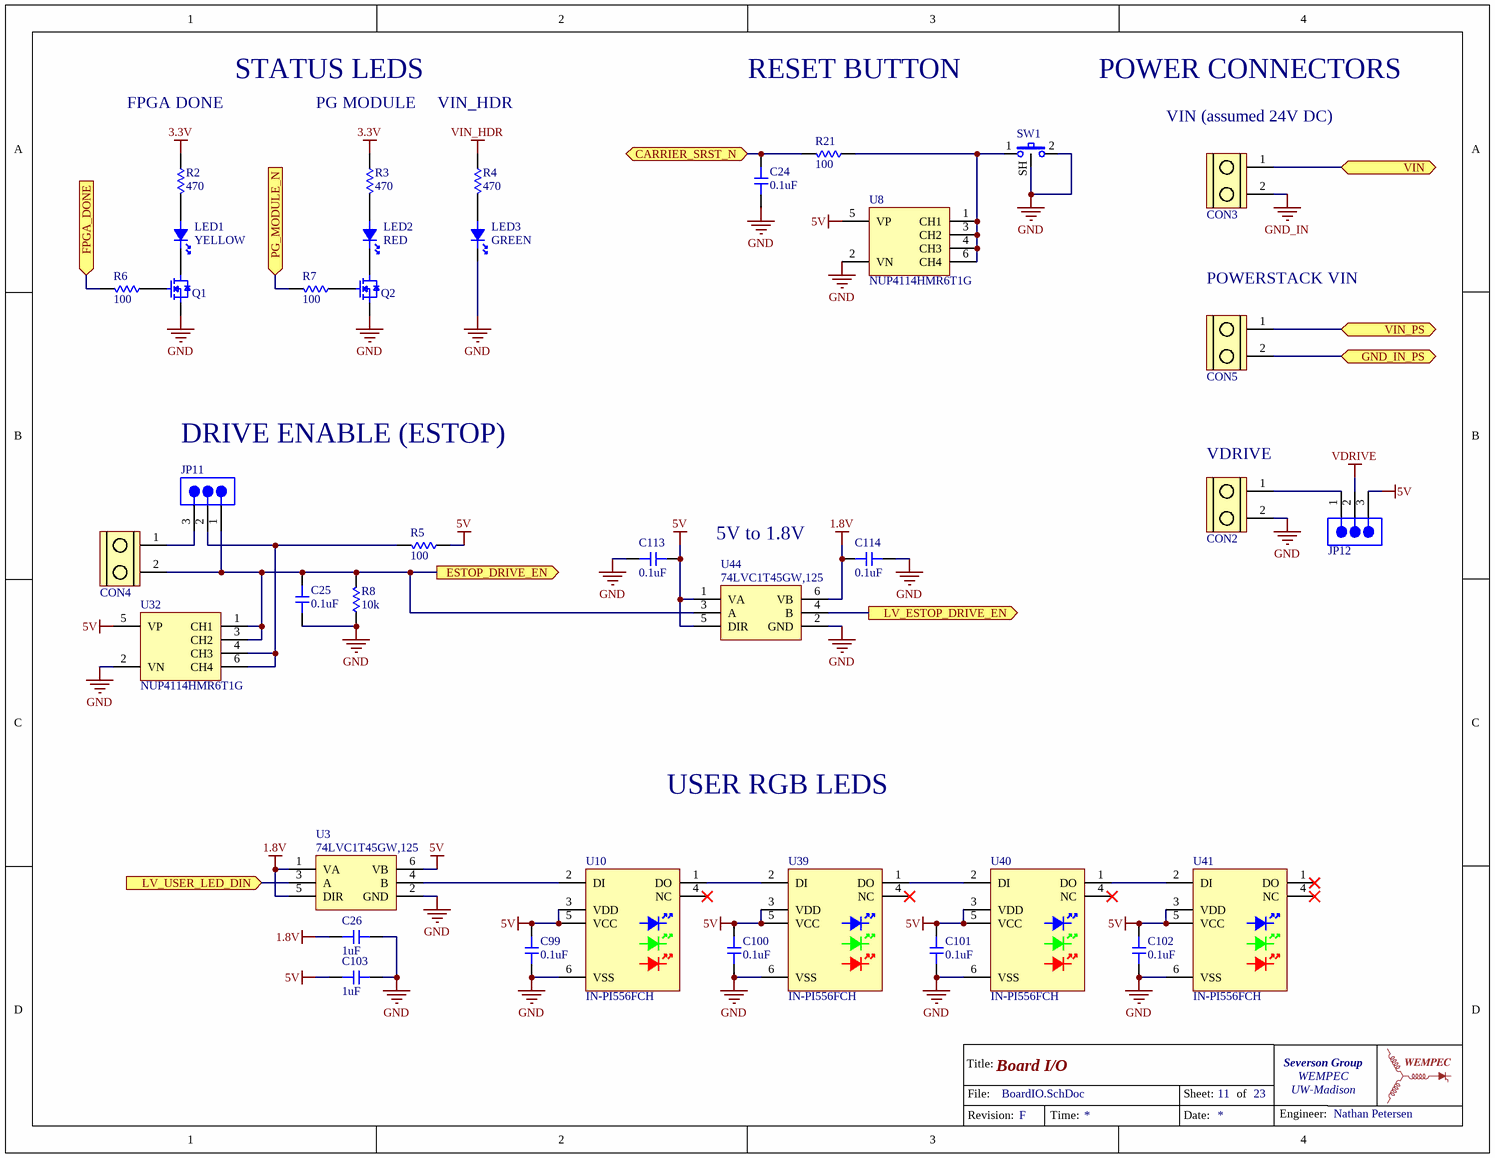
[diagram p15: BoardIO.SchDoc]

### Parts
C24  value 0.1uF  [0603-CAP]  (hidden comment: Capacitor)
C25  value 0.1uF  [0603-CAP]  (hidden comment: Capacitor)
C26  value 1uF  [0603-CAP]  (hidden comment: Capacitor)
C99  value 0.1uF  [0603-CAP]  (hidden comment: Capacitor)
C100  value 0.1uF  [0603-CAP]  (hidden comment: Capacitor)
C101  value 0.1uF  [0603-CAP]  (hidden comment: Capacitor)
C102  value 0.1uF  [0603-CAP]  (hidden comment: Capacitor)
C103  value 1uF  [0603-CAP]  (hidden comment: Capacitor)
C113  value 0.1uF  [0603-CAP]  (hidden comment: Capacitor)
C114  value 0.1uF  [0603-CAP]  (hidden comment: Capacitor)
CON2  ScrewTerminal_1x2  [1935161]  (value not drawn)
CON3  ScrewTerminal_1x2  [1935161]  (value not drawn)
CON4  ScrewTerminal_1x2  [1935161]  (value not drawn)
CON5  ScrewTerminal_1x2  [1935161]  (value not drawn)
JP11  Jumper3  [PIN_HEADER_1X3]  (value not drawn)
JP12  Jumper3  [PIN_HEADER_1X3]  (value not drawn)
LED1  value YELLOW  [0603-LED]  (hidden comment: LED)
LED2  value RED  [0603-LED]  (hidden comment: LED)
LED3  value GREEN  [0603-LED]  (hidden comment: LED)
Q1  MOSFET  [SOT95P245X110-3N]  (value not drawn)
Q2  MOSFET  [SOT95P245X110-3N]  (value not drawn)
R2  value 470  [0603-RES]  (hidden comment: Resistor)
R3  value 470  [0603-RES]  (hidden comment: Resistor)
R4  value 470  [0603-RES]  (hidden comment: Resistor)
R5  value 100  [0603-RES]  (hidden comment: Resistor)
R6  value 100  [0603-RES]  (hidden comment: Resistor)
R7  value 100  [0603-RES]  (hidden comment: Resistor)
R8  value 10k  [0603-RES]  (hidden comment: Resistor)
R21  value 100  [0603-RES]  (hidden comment: Resistor)
SW1  1825027-5  [1825027-5]  (value not drawn)
U3  74LVC1T45GW,125  [SOT65P210X110-6N]
U8  NUP4114HMR6T1G  [TSOP95P280X110-6N]
U10  IN-PI556FCH  [IN-PI556FCH]
U32  NUP4114HMR6T1G  [TSOP95P280X110-6N]
U39  IN-PI556FCH  [IN-PI556FCH]
U40  IN-PI556FCH  [IN-PI556FCH]
U41  IN-PI556FCH  [IN-PI556FCH]
U44  74LVC1T45GW,125  [SOT65P210X110-6N]

### Ports
CARRIER_SRST_N (bidir), ESTOP_DRIVE_EN (out), FPGA_DONE (in), GND_IN_PS (bidir), LV_ESTOP_DRIVE_EN (out), LV_USER_LED_DIN (in), PG_MODULE_N (in), VIN (bidir), VIN_PS (bidir)

### Nets
1.8V: C26.1 C114.1 R7.2 U3.1(VA) U3.5(DIR) U44.6(VB) ; port PG_MODULE_N
3.3V: R2.1 R3.1
5V: C99.2 C100.2 C101.2 C102.2 C103.1 C113.2 JP12.3 R5.1 U3.6(VB) U8.5(VP) U10.3(VDD) U10.5(VCC) U32.5(VP) U39.3(VDD) U39.5(VCC) U40.3(VDD) U40.5(VCC) U41.3(VDD) U41.5(VCC) U44.1(VA) U44.5(DIR)
GND: C24.1 C25.1 C26.2 C99.1 C100.1 C101.1 C102.1 C103.2 C113.1 C114.2 CON2.2 LED3.C Q1.2(S) Q2.2(S) R8.1 SW1.2 SW1.SH U3.2(GND) U8.2(VN) U10.6(VSS) U32.2(VN) U39.6(VSS) U40.6(VSS) U41.6(VSS) U44.2(GND)
GND_IN: CON3.2
VDRIVE: JP12.2
VIN_HDR: R4.1
CARRIER_SRST_N: C24.2 R21.2 ; port CARRIER_SRST_N
ESTOP_DRIVE_EN: C25.2 CON4.2 JP11.1 R8.2 U32.1(CH1) U32.3(CH2) U44.3(A) ; port ESTOP_DRIVE_EN
FPGA_DONE: R6.2 ; port FPGA_DONE
GND_IN_PS: CON5.2 ; port GND_IN_PS
LV_ESTOP_DRIVE_EN: U44.4(B) ; port LV_ESTOP_DRIVE_EN
LV_USER_LED_DIN: U3.3(A) ; port LV_USER_LED_DIN
VIN: CON3.1 ; port VIN
VIN_PS: CON5.1 ; port VIN_PS
NetCON2_1: CON2.1 JP12.1
NetCON4_1: CON4.1 JP11.3
NetJP11_2: JP11.2 R5.2 U32.4(CH3) U32.6(CH4)
NetLED1_A: LED1.A R2.2
NetLED1_C: LED1.C Q1.3(D)
NetLED2_A: LED2.A R3.2
NetLED2_C: LED2.C Q2.3(D)
NetLED3_A: LED3.A R4.2
NetQ1_1: Q1.1(G) R6.1
NetQ2_1: Q2.1(G) R7.1
NetR21_1: R21.1 SW1.1 U8.1(CH1) U8.3(CH2) U8.4(CH3) U8.6(CH4)
NetU3_4: U3.4(B) U10.2(DI)
NetU10_1: U10.1(DO) U39.2(DI)
NetU39_1: U39.1(DO) U40.2(DI)
NetU40_1: U40.1(DO) U41.2(DI)

Not connected (* = marked no-connect by the designer): U10 4(NC)*; U39 4(NC)*; U40 4(NC)*; U41 1(DO)* 4(NC)*

### Notes on the sheet
- STATUS LEDS
- RESET BUTTON
- POWER CONNECTORS
- FPGA DONE
- PG MODULE
- VIN_HDR
- (near CON3) VIN (assumed 24V DC)
- (near CON5) POWERSTACK VIN
- DRIVE ENABLE (ESTOP)
- (near CON2) VDRIVE
- 5V to 1.8V
- USER RGB LEDS
- Title:
- File:
- Sheet:
- of
- Revision:
- Time:
- Date:
- Engineer:

### Library data of the parts
SW1 = 1825027-5: SWITCH TACTILE SPST-NO 0.05A 24V; Supplier 1: Digi-Key; Supplier Part Number 1: 450-1662-ND
U3 U44 = 74LVC1T45GW,125: TXRX XLATING DUAL 3ST 6TSSOP; Supplier 1: Digi-Key; Supplier Part Number 1: 1727-4560-1-ND
U8 U32 = NUP4114HMR6T1G: TVS DIODE 5.5V 10V 6TSOP; Supplier 1: Digi-Key; Supplier Part Number 1: NUP4114HMR6T1GOSCT-ND
U10 U39-U41 = IN-PI556FCH: LED RGB 5050 SMD; Supplier 1: Digi-Key; Supplier Part Number 1: 1830-1107-1-ND
C24-C26 C99-C103 C113 C114 = Capacitor: Supplier 1: Digi-Key
  C24 C25 C99-C102 C113 C114: Supplier Part Number 1: 1276-1012-6-ND
  C26 C103: Supplier Part Number 1: 1276-6524-6-ND
CON2-CON5 = ScrewTerminal_1x2: Supplier 1: Digi-Key; Supplier Part Number 1: 277-1667-ND
JP11 JP12 = Jumper3: Supplier 1: Digi-Key; Supplier Part Number 1: 732-5316-ND
LED1-LED3 = LED: Supplier 1: Digi-Key
  LED1: Supplier Part Number 1: 160-1448-6-ND
  LED2: Supplier Part Number 1: 160-1447-6-ND
  LED3: Supplier Part Number 1: 160-1446-6-ND
Q1 Q2 = MOSFET: Supplier 1: Digi-Key; Supplier Part Number 1: FDV301NCT-ND
R2-R8 R21 = Resistor: Supplier 1: Digi-Key
  R2-R4: Supplier Part Number 1: 311-470LDCT-ND
  R5-R7 R21: Supplier Part Number 1: YAG3561DKR-ND
  R8: Supplier Part Number 1: P10.0KHCT-ND

## Sheet Power.SchDoc: Power
size Letter; Engineer: Nathan Petersen; DocumentNumber: 3; Revision: v1.2; SheetNumber: 3; SheetTotal: 23
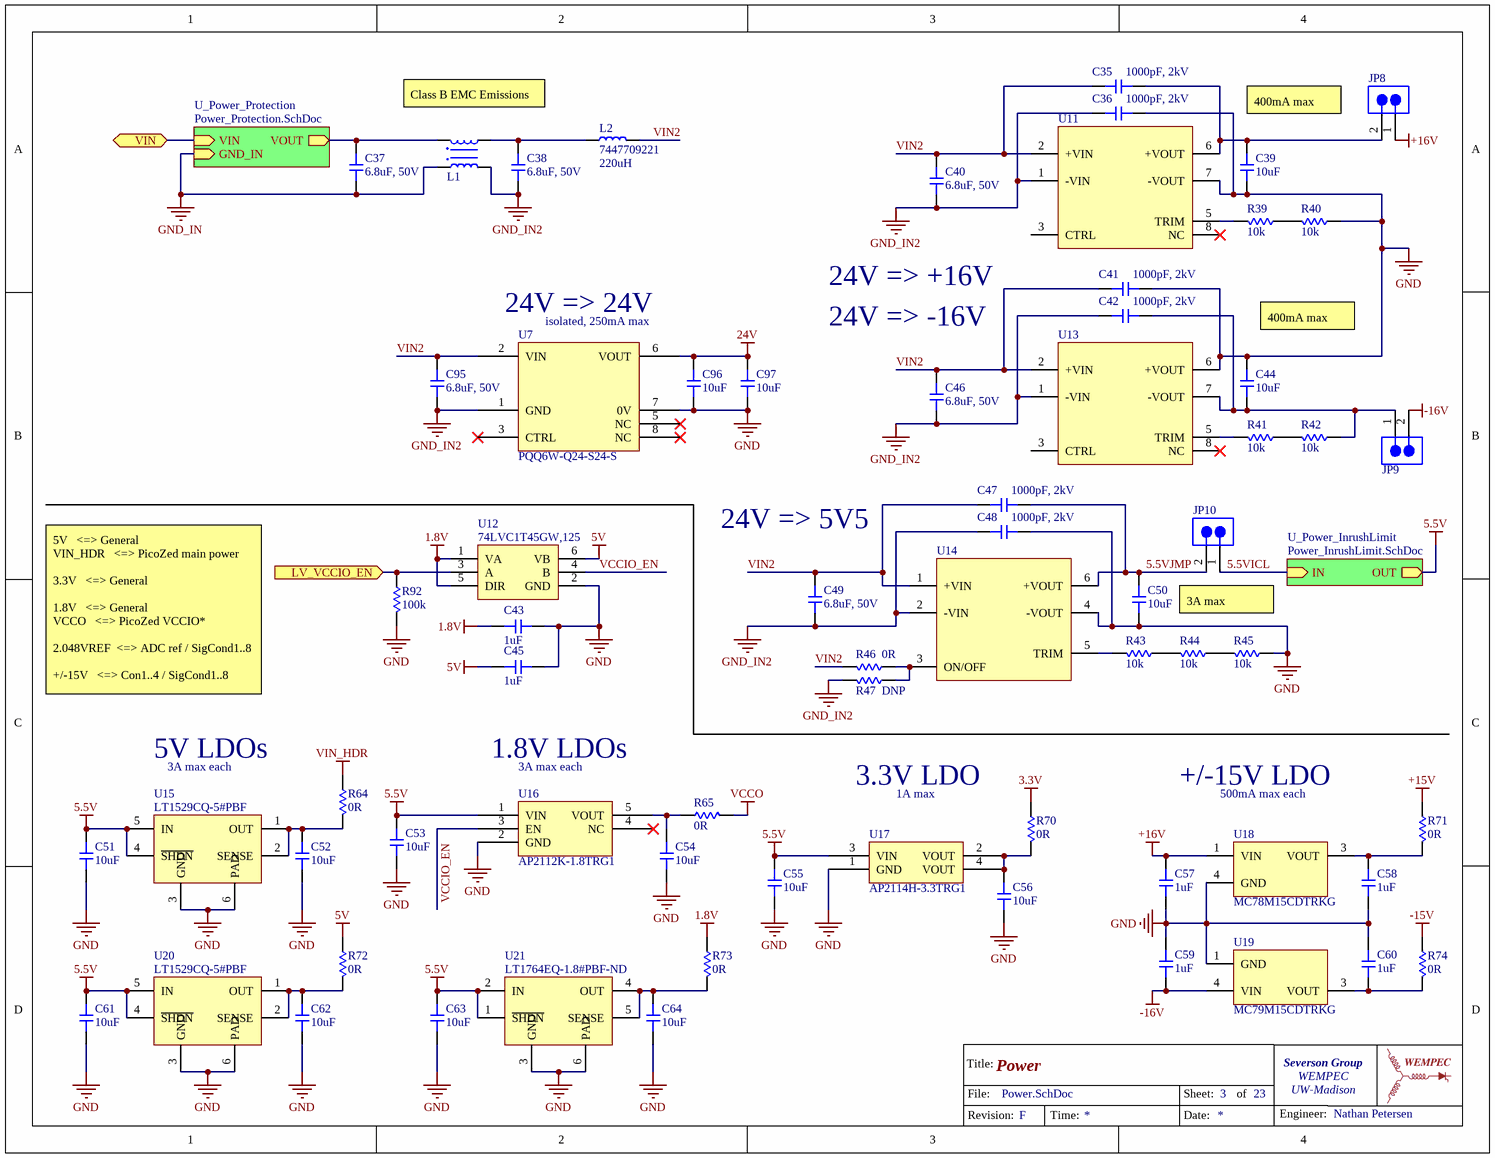
[diagram p16: Power.SchDoc]

### Parts
C35  value 1000pF, 2kV  [1808-CAP]  (hidden comment: Capacitor)
C36  value 1000pF, 2kV  [1808-CAP]  (hidden comment: Capacitor)
C37  value 6.8uF, 50V  [1812-CAP]  (hidden comment: Capacitor)
C38  value 6.8uF, 50V  [1812-CAP]  (hidden comment: Capacitor)
C39  value 10uF  [0603-CAP]  (hidden comment: Capacitor)
C40  value 6.8uF, 50V  [1812-CAP]  (hidden comment: Capacitor)
C41  value 1000pF, 2kV  [1808-CAP]  (hidden comment: Capacitor)
C42  value 1000pF, 2kV  [1808-CAP]  (hidden comment: Capacitor)
C43  value 1uF  [0603-CAP]  (hidden comment: Capacitor)
C44  value 10uF  [0603-CAP]  (hidden comment: Capacitor)
C45  value 1uF  [0603-CAP]  (hidden comment: Capacitor)
C46  value 6.8uF, 50V  [1812-CAP]  (hidden comment: Capacitor)
C47  value 1000pF, 2kV  [1808-CAP]  (hidden comment: Capacitor)
C48  value 1000pF, 2kV  [1808-CAP]  (hidden comment: Capacitor)
C49  value 6.8uF, 50V  [1812-CAP]  (hidden comment: Capacitor)
C50  value 10uF  [0603-CAP]  (hidden comment: Capacitor)
C51  value 10uF  [0603-CAP]  (hidden comment: Capacitor)
C52  value 10uF  [0603-CAP]  (hidden comment: Capacitor)
C53  value 10uF  [0603-CAP]  (hidden comment: Capacitor)
C54  value 10uF  [0603-CAP]  (hidden comment: Capacitor)
C55  value 10uF  [0603-CAP]  (hidden comment: Capacitor)
C56  value 10uF  [0603-CAP]  (hidden comment: Capacitor)
C57  value 1uF  [0603-CAP]  (hidden comment: Capacitor)
C58  value 1uF  [0603-CAP]  (hidden comment: Capacitor)
C59  value 1uF  [0603-CAP]  (hidden comment: Capacitor)
C60  value 1uF  [0603-CAP]  (hidden comment: Capacitor)
C61  value 10uF  [0603-CAP]  (hidden comment: Capacitor)
C62  value 10uF  [0603-CAP]  (hidden comment: Capacitor)
C63  value 10uF  [0603-CAP]  (hidden comment: Capacitor)
C64  value 10uF  [0603-CAP]  (hidden comment: Capacitor)
C95  value 6.8uF, 50V  [1812-CAP]  (hidden comment: Capacitor)
C96  value 10uF  [0603-CAP]  (hidden comment: Capacitor)
C97  value 10uF  [0603-CAP]  (hidden comment: Capacitor)
JP8  Jumper2  [PIN_HEADER_1x2]  (value not drawn)
JP9  Jumper2  [PIN_HEADER_1x2]  (value not drawn)
JP10  Jumper2  [PIN_HEADER_1x2]  (value not drawn)
L1  CMC  744273801  [CMC 744273801]  (value not drawn)
L2  7447709221  value 220uH  [7447709221]
R39  value 10k  [0603-RES]  (hidden comment: Resistor)
R40  value 10k  [0603-RES]  (hidden comment: Resistor)
R41  value 10k  [0603-RES]  (hidden comment: Resistor)
R42  value 10k  [0603-RES]  (hidden comment: Resistor)
R43  value 10k  [0603-RES]  (hidden comment: Resistor)
R44  value 10k  [0603-RES]  (hidden comment: Resistor)
R45  value 10k  [0603-RES]  (hidden comment: Resistor)
R46  value 0R  [1206-RES]  (hidden comment: Resistor)
R47  value DNP  [1206-RES]  (hidden comment: Resistor)
R64  value 0R  [1206-RES]  (hidden comment: Resistor)
R65  value 0R  [1206-RES]  (hidden comment: Resistor)
R70  value 0R  [1206-RES]  (hidden comment: Resistor)
R71  value 0R  [1206-RES]  (hidden comment: Resistor)
R72  value 0R  [1206-RES]  (hidden comment: Resistor)
R73  value 0R  [1206-RES]  (hidden comment: Resistor)
R74  value 0R  [1206-RES]  (hidden comment: Resistor)
R92  value 100k  [0603-RES]  (hidden comment: Resistor)
U7  PQQ6W-Q24-S24-S  [PQQ6W-Q24-S24-S]
U11  DCDC Converter RS6  [RS6 DCDC]  (value not drawn)
U12  74LVC1T45GW,125  [SOT65P210X110-6N]
U13  DCDC Converter RS6  [RS6 DCDC]  (value not drawn)
U14  SHHD003A0A4Z  [DCDC SHHD003A0A41-SRZ]  (value not drawn)
U15  LT1529CQ-5#PBF  [5-DDPAK]
U16  AP2112K-1.8TRG1  [SOT95P280X145-5N]
U17  AP2114H-3.3TRG1  [SOT230P700X180-4N]
U18  MC78M15CDTRKG  [DPAK229P991X238-3N]
U19  MC79M15CDTRKG  [DPAK229P991X238-3N]
U20  LT1529CQ-5#PBF  [5-DDPAK]
U21  LT1764EQ-1.8#PBF-ND  [5-DDPAK]

### Sub-sheets
U_Power_InrushLimit = Power_InrushLimit.SchDoc: IN (in), OUT (out)
U_Power_Protection = Power_Protection.SchDoc: VIN (in), VOUT (out), GND_IN (in)

### Ports
LV_VCCIO_EN (in), VIN (bidir)

### Nets
1.8V: C43.1 R73.1 U12.1(VA) U12.5(DIR)
3.3V: R70.1
5.5V: C51.1 C53.1 C55.1 C61.1 C63.1 U15.4(~{SHDN}) U15.5(IN) U16.1(VIN) U17.3(VIN) U20.4(~{SHDN}) U20.5(IN) U21.1(~{SHDN}) U21.2(IN) ; sheet U_Power_InrushLimit/OUT
5V: C45.1 R72.1 U12.6(VB)
24V: C96.2 C97.2 U7.6(VOUT)
+15V: R71.1
+16V: C57.2 JP8.1 U18.1(VIN)
-15V: R74.1
-16V: C59.1 JP9.2 U19.4(VIN)
GND: C36.2 C39.1 C41.2 C43.2 C44.2 C45.2 C48.2 C50.1 C51.2 C52.2 C53.2 C54.2 C55.2 C56.2 C57.1 C58.1 C59.2 C60.2 C61.2 C62.2 C63.2 C64.2 C96.1 C97.1 R40.1 R45.1 R92.2 U7.7(0V) U11.7(-VOUT) U12.2(GND) U13.6(+VOUT) U14.4(-VOUT) U15.3(GND) U15.6(PAD) U16.2(GND) U17.1(GND) U18.4(GND) U19.1(GND) U20.3(GND) U20.6(PAD) U21.3(GND) U21.6(PAD)
GND_IN: C37.1 L1.2 ; sheet U_Power_Protection/GND_IN
GND_IN2: C36.1 C38.1 C40.1 C42.1 C46.1 C48.1 C49.1 C95.1 L1.3 R47.2 U7.1(GND) U11.1(-VIN) U13.1(-VIN) U14.2(-VIN)
VCCO: R65.2
VIN_HDR: R64.1
5.5VICL: JP10.1 ; sheet U_Power_InrushLimit/IN
5.5VJMP: C47.2 C50.2 JP10.2 U14.6(+VOUT)
LV_VCCIO_EN: R92.1 U12.3(A) ; port LV_VCCIO_EN
VCCIO_EN: U12.4(B) U16.3(EN)
VIN: port VIN, sheet U_Power_Protection/VIN
VIN2: C35.1 C40.2 C41.1 C46.2 C47.1 C49.2 C95.2 L2.1 R46.2 U7.2(VIN) U11.2(+VIN) U13.2(+VIN) U14.1(+VIN)
NetC35_2: C35.2 C39.2 JP8.2 U11.6(+VOUT)
NetC37_2: C37.2 L1.1 ; sheet U_Power_Protection/VOUT
NetC38_2: C38.2 L1.4 L2.2
NetC42_2: C42.2 C44.1 JP9.1 R42.1 U13.7(-VOUT)
NetC52_1: C52.1 R64.2 U15.1(OUT) U15.2(SENSE)
NetC54_1: C54.1 R65.1 U16.5(VOUT)
NetC56_1: C56.1 R70.2 U17.2(VOUT) U17.4(VOUT)
NetC58_2: C58.2 R71.2 U18.3(VOUT)
NetC60_1: C60.1 R74.2 U19.3(VOUT)
NetC62_1: C62.1 R72.2 U20.1(OUT) U20.2(SENSE)
NetC64_1: C64.1 R73.2 U21.4(OUT) U21.5(SENSE)
NetR39_1: R39.1 R40.2
NetR39_2: R39.2 U11.5(TRIM)
NetR41_1: R41.1 R42.2
NetR41_2: R41.2 U13.5(TRIM)
NetR43_1: R43.1 R44.2
NetR43_2: R43.2 U14.5(TRIM)
NetR44_1: R44.1 R45.2
NetR46_1: R46.1 R47.1 U14.3(ON/OFF)

Not connected (* = marked no-connect by the designer): U7 3(CTRL)* 5(NC)* 8(NC)*; U11 3(CTRL) 8(NC)*; U13 3(CTRL) 8(NC)*; U16 4(NC)*

### Notes on the sheet
- Class B EMC Emissions
- 400mA max
- (near U7) 24V => 24V
- 24V => +16V
- (near U7) isolated, 250mA max
- 24V => -16V
- (near C44) 400mA max
- (near C49) 24V => 5V5
- 3A max
- 5V	  <=> General
  VIN_HDR	  <=> PicoZed main power
  3.3V	  <=> General
  1.8V	  <=> General
  VCCO	  <=> PicoZed VCCIO*
  2.048VREF  <=> ADC ref / SigCond1..8
  +/-15V	  <=> Con1..4 / SigCond1..8
- 5V LDOs
- 3A max each
- 1.8V LDOs
- (near U16) 3A max each
- 3.3V LDO
- +/-15V LDO
- 1A max
- 500mA max each
- Title:
- File:
- Sheet:
- of
- Revision:
- Time:
- Date:
- Engineer:

### Library data of the parts
L1 = CMC  744273801: CMC 450UH 6.5A 2LN TH; Supplier 1: Digi-Key; Supplier Part Number 1: 732-2215-6-ND
L2 = 7447709221: FIXED IND 220UH 1.8A 300 MOHM; Supplier Part Number 1: 732-1696-1-ND; Supplier 1: Digi-Key
U7 = PQQ6W-Q24-S24-S: DC-DC ISOLATED, 6 W, 9~36 VDC IN; Supplier 1: Digi-Key; Supplier Part Number 1: 102-PQQ6W-Q24-S24-S-ND
U11 U13 = DCDC Converter RS6: Recom RS6; Supplier 1: Digi-Key; Supplier Part Number 1: 945-2987-ND
U12 = 74LVC1T45GW,125: TXRX XLATING DUAL 3ST 6TSSOP; Supplier 1: Digi-Key; Supplier Part Number 1: 1727-4560-1-ND
U14 = DCDC Converter SHHD003A0A41Z: DC DC CONVERTER 5V 15W; Supplier 1: Digi-Key; Supplier Part Number 1: 555-1312-ND
U15 U20 = LT1529CQ-5#PBF: IC REG LINEAR 5V 3A 5DDPAK; Supplier 1: Digi-Key; Supplier Part Number 1: LT1529CQ-5#PBF-ND
U16 = AP2112K-1.8TRG1: IC REG LINEAR 1.8V 600MA SOT25; Supplier 1: Digi-Key; Supplier Part Number 1: AP2112K-1.8TRG1DICT-ND
U17 = AP2114H-3.3TRG1: IC REG LINEAR 3.3V 1A SOT223; Supplier 1: Digi-Key; Supplier Part Number 1: AP2114H-3.3TRG1DICT-ND
U18 = MC78M15CDTRKG: IC REG LINEAR 15V 500MA DPAK; Supplier 1: Digi-Key; Supplier Part Number 1: MC78M15CDTRKGOSCT-ND
U19 = MC79M15CDTRKG: IC REG LINEAR -15V 500MA DPAK; Supplier 1: Digi-Key; Supplier Part Number 1: MC79M15CDTRKGOSCT-ND
U21 = LT1764EQ-1.8#PBF-ND: IC REG LINEAR 1.8V 3A 5DDPAK; Supplier 1: Digi-Key; Supplier Part Number 1: LT1764EQ-1.8#PBF-ND
C35-C64 C95-C97 = Capacitor: Supplier 1: Digi-Key
  C35 C36 C41 C42 C47 C48: Supplier Part Number 1: 709-1046-6-ND
  C37 C38 C40 C46 C49 C95: Supplier Part Number 1: 445-3919-6-ND
  C39 C44 C50 C96 C97: Supplier Part Number 1: 445-9015-6-ND
  C43 C45 C57-C60: Supplier Part Number 1: 1276-6524-6-ND
  C51-C56 C61-C64: Supplier Part Number 1: 1276-1192-6-ND
JP8-JP10 = Jumper2: Supplier 1: Digi-Key; Supplier Part Number 1: 732-5315-ND
R39-R47 R64 R65 R70-R74 R92 = Resistor: Supplier 1: Digi-Key
  R39-R45: Supplier Part Number 1: P10.0KHCT-ND
  R46 R47 R64 R65 R70-R74: Supplier Part Number 1: 311-0.0ERCT-ND
  R92: Supplier Part Number 1: 311-100KLDCT-ND

## Sheet Power_Protection.SchDoc: Power Protection
size Letter; DrawnBy: Nathan Petersen; Engineer: Nathan Petersen; Organization: Altium Limited; Address1: L3, 12a Rodborough Rd; Address2: Frenchs Forest; Address3: NSW; Address4: Australia 2086; DocumentNumber: 4; Revision: v1.2; SheetNumber: 4; SheetTotal: 23
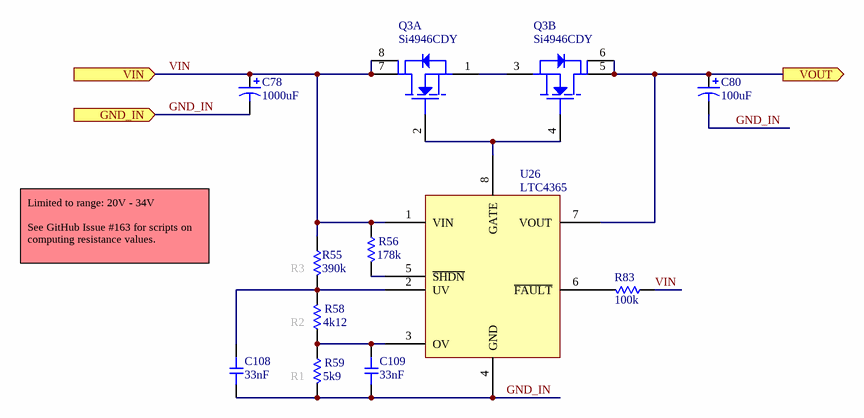
[diagram p17: Power_Protection.SchDoc]

### Parts
C78  value 1000uF  [CAP - UVR1H102MHD1TO]  (hidden comment: Cap Pol1)
C80  value 100uF  [CAP - UWT1V101MCL1GS]  (hidden comment: Cap Pol1)
C108  value 33nF  [0603-CAP]  (hidden comment: Capacitor)
C109  value 33nF  [0603-CAP]  (hidden comment: Capacitor)
Q3  Si4946CDY  [SOIC127P600X175-8N]  (parts A,B of 2)
R55  value 390k  [0603-RES]  (hidden comment: Resistor)
R56  value 178k  [0603-RES]  (hidden comment: Resistor)
R58  value 4k12  [0603-RES]  (hidden comment: Resistor)
R59  value 5k9  [0603-RES]  (hidden comment: Resistor)
R83  value 100k  [0603-RES]  (hidden comment: Resistor)
U26  LTC4365  [TSOP65P280X100-8N]

### Ports
GND_IN (in), VIN (in), VOUT (out)

### Nets
GND_IN: C78.2 C80.2 C108.2 C109.2 R59.2 U26.4(GND) ; port GND_IN
VIN: C78.1 Q3.7(D1) Q3.8(D1) R55.1 R56.1 R83.1 U26.1(VIN) ; port VIN
NetC37_2: C80.1 Q3.5(D2) Q3.6(D2) U26.7(VOUT) ; port VOUT
NetC108_1: C108.1 R55.2 R58.2 U26.2(UV)
NetC109_1: C109.1 R58.1 R59.1 U26.3(OV)
NetQ3_1: Q3.1(S1) Q3.3(S2)
NetQ3_2: Q3.2(G1) Q3.4(G2) U26.8(GATE)
NetR56_2: R56.2 U26.5(~{SHDN})
NetR83_2: R83.2 U26.6(~{FAULT})

### Notes on the sheet
- Limited to range: 20V - 34V
  See GitHub Issue #163 for scripts on computing resistance values.
- (near R55) R3
- (near R58) R2
- (near R59) R1
- Title:
- File:
- Sheet:
- of
- Revision:
- Time:
- Date:
- Engineer:

### Library data of the parts
C78 C80 = Cap Pol1: Polarized Capacitor (Radial); Supplier 1: Digi-Key
  C78: Supplier Part Number 1: 493-12786-1-ND
  C80: Supplier Part Number 1: 493-2203-6-ND
Q3 = SI4946CDY-T1-GE3: MOSFET N-CHAN DUAL 60V SO-8; Supplier 1: Digi-Key; Supplier Part Number 1: SI4946CDY-T1-GE3DKR-ND
U26 = LTC4365CTS8#TRMPBF: IC OVERVOLTAGE PROT TSOT23-8; Supplier 1: Digi-Key; Supplier Part Number 1: LTC4365CTS8#TRMPBFCT-ND
C108 C109 = Capacitor: Supplier 1: Digi-Key; Supplier Part Number 1: 1276-2041-1-ND
R55 R56 R58 R59 R83 = Resistor: Supplier 1: Digi-Key
  R55: Supplier Part Number 1: 311-390KHRCT-ND
  R56: Supplier Part Number 1: 311-178KHRCT-ND
  R58: Supplier Part Number 1: 311-4.12KHRCT-ND
  R59: Supplier Part Number 1: 311-5.90KHRCT-ND
  R83: Supplier Part Number 1: 311-100KLDCT-ND

## Sheet Power_InrushLimit.SchDoc: Inrush Current Limiter
size Letter; Engineer: Nathan Petersen; DocumentNumber: 5; SheetNumber: 5; SheetTotal: 23
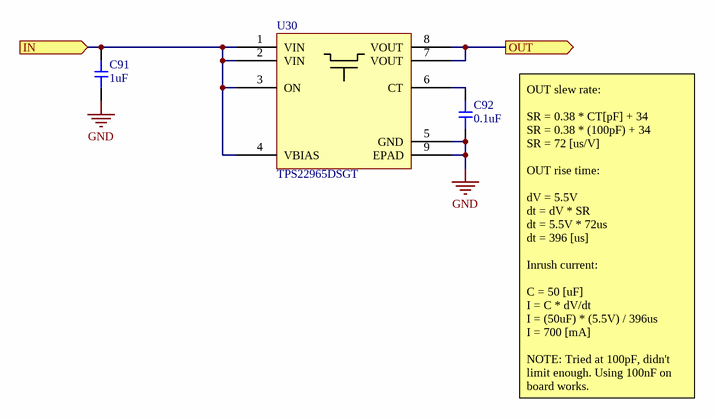
[diagram p18: Power_InrushLimit.SchDoc]

### Parts
C91  value 1uF  [0603-CAP]  (hidden comment: Capacitor)
C92  value 0.1uF  [0603-CAP]  (hidden comment: Capacitor)
U30  TPS22965DSGT  [SON50P200X80_HS-9N]

### Ports
IN (in), OUT (out)

### Nets
5.5V: U30.7(VOUT) U30.8(VOUT) ; port OUT
GND: C91.1 C92.1 U30.5(GND) U30.9(EPAD)
5.5VICL: C91.2 U30.1(VIN) U30.2(VIN) U30.3(ON) U30.4(VBIAS) ; port IN
NetC92_2: C92.2 U30.6(CT)

### Notes on the sheet
- OUT slew rate:
  SR = 0.38 * CT[pF] + 34
  SR = 0.38 * (100pF) + 34
  SR = 72 [us/V]
  OUT rise time:
  dV = 5.5V
  dt = dV * SR
  dt = 5.5V * 72us
  dt = 396 [us]
  Inrush current:
  C = 50 [uF]
  I = C * dV/dt
  I = (50uF) * (5.5V) / 396us
  I = 700 [mA]
  NOTE: Tried at 100pF, didn't limit enough. Using 100nF on board works.
- Title:
- File:
- Sheet:
- of
- Revision:
- Time:
- Date:
- Engineer:

### Library data of the parts
U30 = TPS22965DSGT: IC LOAD SWITCH 6A 8WSON; Supplier 1: Digi-Key; Supplier Part Number 1: 296-34943-1-ND
C91 C92 = Capacitor: Supplier 1: Digi-Key
  C91: Supplier Part Number 1: 1276-6524-6-ND
  C92: Supplier Part Number 1: 1276-1012-6-ND

## Sheet JTAG_UART.SchDoc: Host Interface: JTAG and UART
size Letter; Engineer: Nathan Petersen; DocumentNumber: 21; SheetNumber: 21; SheetTotal: 23
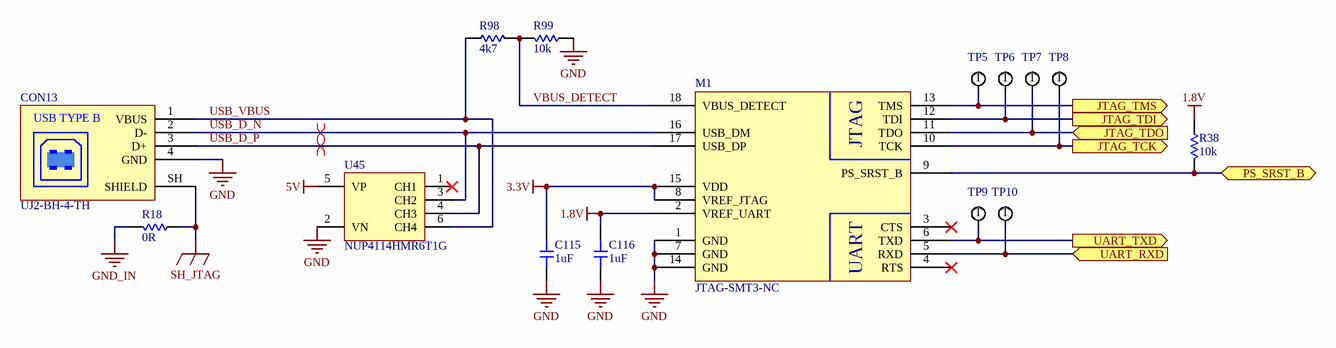
[diagram p19: JTAG_UART.SchDoc]

### Parts
C115  value 1uF  [0603-CAP]  (hidden comment: Capacitor)
C116  value 1uF  [0603-CAP]  (hidden comment: Capacitor)
CON13  UJ2-BH-4-TH  [UJ2-BH-4-TH]
M1  JTAG-SMT3-NC  [JTAG-SMT3-NC]
R18  value 0R  [1206-RES]  (hidden comment: Resistor)
R38  value 10k  [0603-RES]  (hidden comment: Resistor)
R98  value 4k7  [0603-RES]  (hidden comment: Resistor)
R99  value 10k  [0603-RES]  (hidden comment: Resistor)
TP5  Test Point  [TP-125]  (value not drawn)  (no BOM)
TP6  Test Point  [TP-125]  (value not drawn)  (no BOM)
TP7  Test Point  [TP-125]  (value not drawn)  (no BOM)
TP8  Test Point  [TP-125]  (value not drawn)  (no BOM)
TP9  Test Point  [TP-125]  (value not drawn)  (no BOM)
TP10  Test Point  [TP-125]  (value not drawn)  (no BOM)
U45  NUP4114HMR6T1G  [TSOP95P280X110-6N]

### Ports
JTAG_TCK (out), JTAG_TDI (out), JTAG_TDO (in), JTAG_TMS (out), PS_SRST_B (bidir), UART_RXD (in), UART_TXD (out)

### Nets
1.8V: C116.2 M1.2(VREF_UART) R38.1
3.3V: C115.2 M1.8(VREF_JTAG) M1.15(VDD)
5V: U45.5(VP)
GND: C115.1 C116.1 CON13.4(GND) M1.1(GND) M1.7(GND) M1.14(GND) R99.1 U45.2(VN)
GND_IN: R18.2
SH_JTAG: CON13.SH(SHIELD) R18.1
CARRIER_SRST_N: M1.9(PS_SRST_B) R38.2 ; port PS_SRST_B
JTAG_TCK: M1.10(TCK) TP8.1 ; port JTAG_TCK
JTAG_TDI: M1.12(TDI) TP6.1 ; port JTAG_TDI
JTAG_TDO: M1.11(TDO) TP7.1 ; port JTAG_TDO
JTAG_TMS: M1.13(TMS) TP5.1 ; port JTAG_TMS
USB_D_N: CON13.2(D-) M1.16(USB_DM) U45.3(CH2)
USB_D_P: CON13.3(D+) M1.17(USB_DP) U45.4(CH3)
USB_UART_RXD: M1.5(RXD) TP10.1 ; port UART_RXD
USB_UART_TXD: M1.6(TXD) TP9.1 ; port UART_TXD
USB_VBUS: CON13.1(VBUS) R98.1 U45.6(CH4)
VBUS_DETECT: M1.18(VBUS_DETECT) R98.2 R99.2

Not connected (* = marked no-connect by the designer): M1 3(CTS)* 4(RTS)*; U45 1(CH1)*

### Layout directives
differential pair: USB_D_N, USB_D_P

### Notes on the sheet
- Title:
- File:
- Sheet:
- of
- Revision:
- Time:
- Date:
- Engineer:
- (in symbol JTAG-SMT3-NC) JTAG; UART
- (in symbol Test Point) T
- (in symbol UJ2-BH-4-TH) USB TYPE B

### Library data of the parts
CON13 = UJ2-BH-4-TH: CONN RCPT USB2.0 TYPEB 4POS R/A; Supplier 1: Digi-Key; Supplier Part Number 1: 102-5885-ND
M1 = JTAG-SMT3-NC: JTAG-SMT3-NC: SURFACE-MOUNT PROG; Supplier 1: Digi-Key; Supplier Part Number 1: 1286-1196-ND
U45 = NUP4114HMR6T1G: TVS DIODE 5.5V 10V 6TSOP; Supplier 1: Digi-Key; Supplier Part Number 1: NUP4114HMR6T1GOSCT-ND
C115 C116 = Capacitor: Supplier 1: Digi-Key; Supplier Part Number 1: 1276-6524-6-ND
R18 R38 R98 R99 = Resistor: Supplier 1: Digi-Key
  R18: Supplier Part Number 1: 311-0.0ERCT-ND
  R38 R99: Supplier Part Number 1: P10.0KHCT-ND
  R98: Supplier Part Number 1: 311-4.70KHRCT-ND